# EAGLE design main_board (EAGLE 9.6.2)

## Sheet 1 of 4
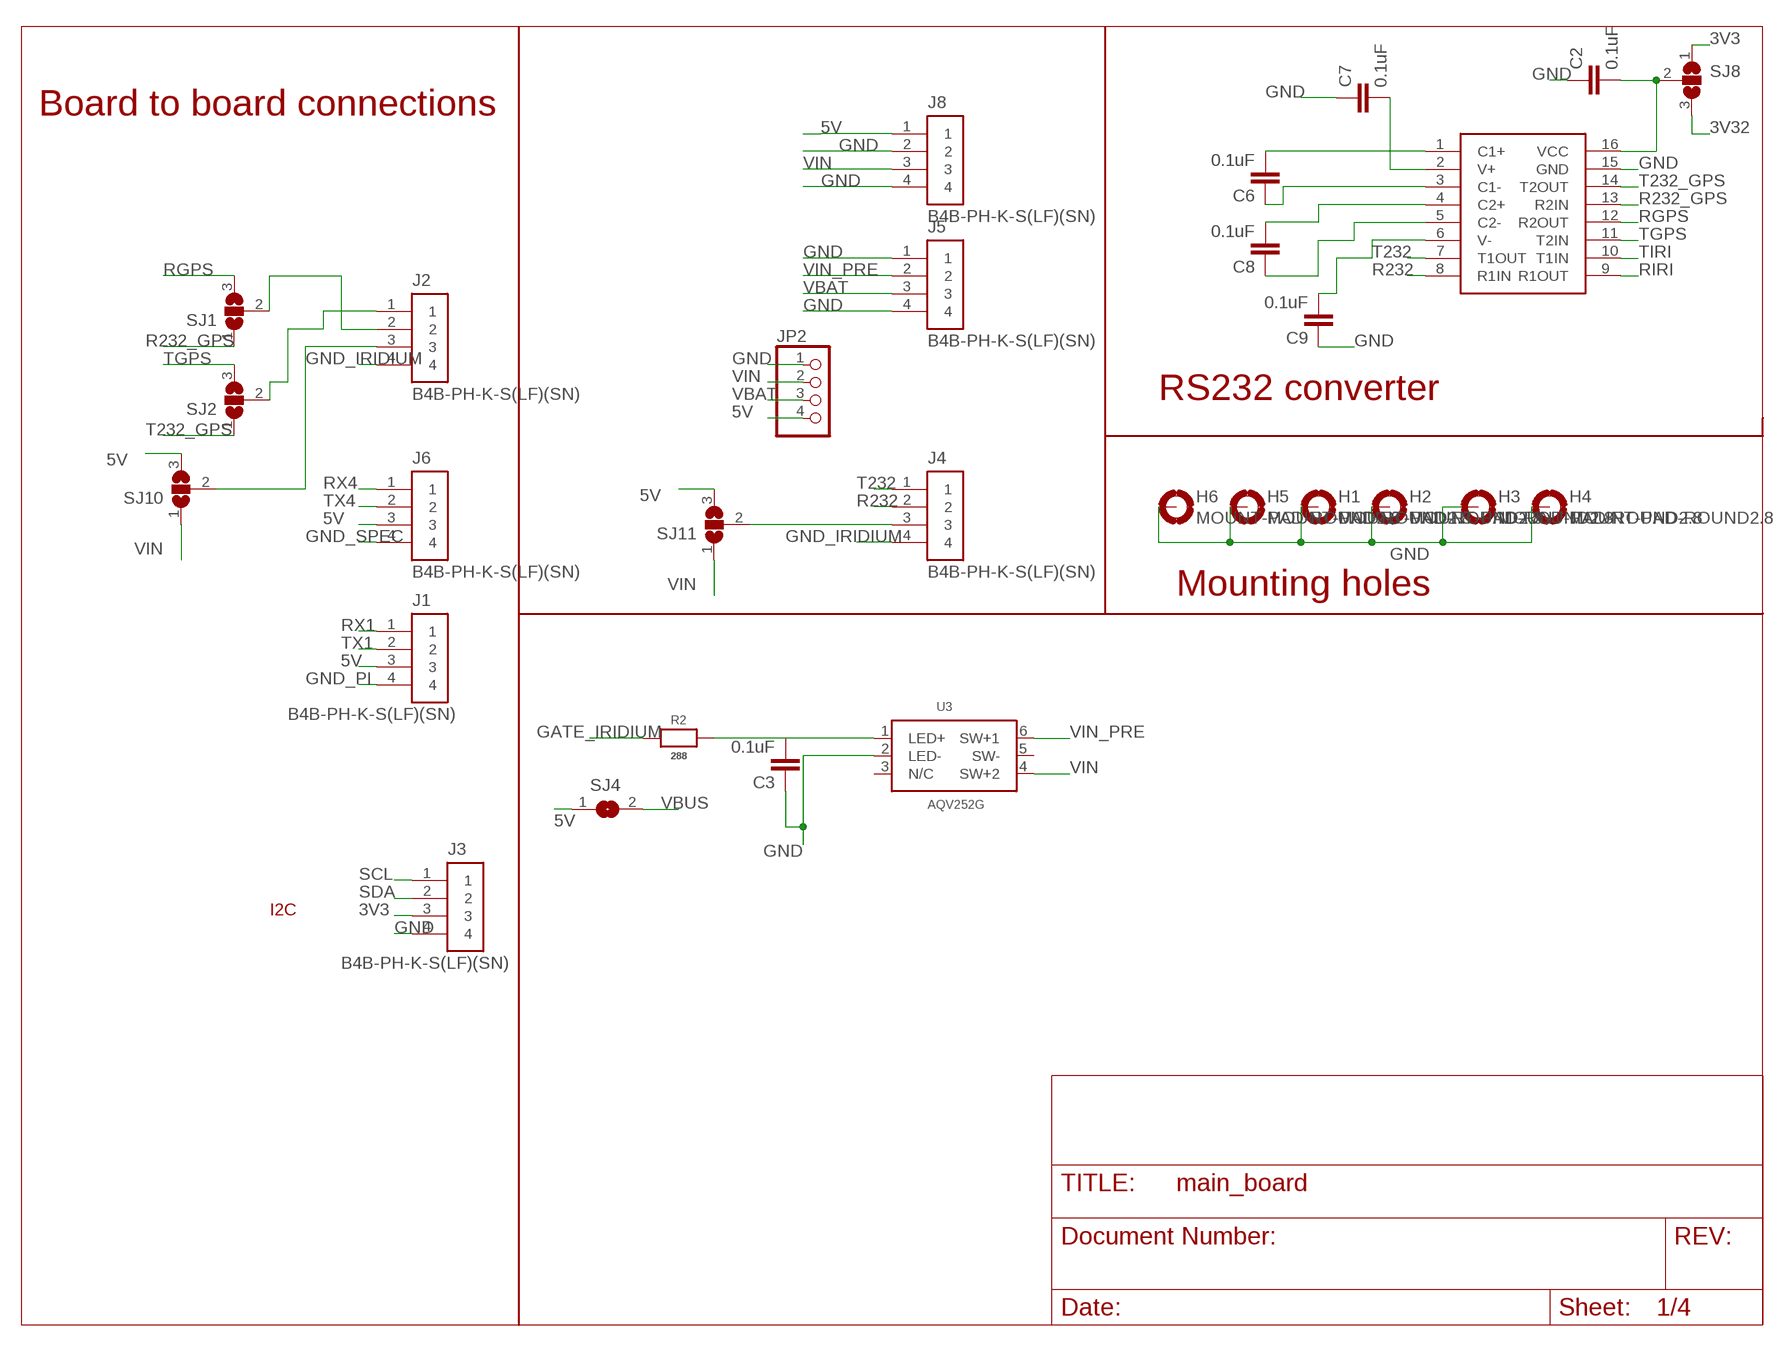
[diagram p0: schematic, sheet 1]

### Parts
C2  0.1uF  C-EUC0603  [C0603]
C3  0.1uF  C-EUC0603  [C0603]
C6  0.1uF  C-EUC0603  [C0603]
C7  0.1uF  C-EUC0603  [C0603]
C8  0.1uF  C-EUC0603  [C0603]
C9  0.1uF  C-EUC0603  [C0603]
H1  MOUNT-PAD-ROUND2.8  [2,8-PAD]
H2  MOUNT-PAD-ROUND2.8  [2,8-PAD]
H3  MOUNT-PAD-ROUND2.8  [2,8-PAD]
H4  MOUNT-PAD-ROUND2.8  [2,8-PAD]
H5  MOUNT-PAD-ROUND2.8  [2,8-PAD]
H6  MOUNT-PAD-ROUND2.8  [2,8-PAD]
J1  B4B-PH-K-S(LF)(SN)  [JST_B4B-PH-K-S(LF)(SN)]
J2  B4B-PH-K-S(LF)(SN)  [JST_B4B-PH-K-S(LF)(SN)]
J3  B4B-PH-K-S(LF)(SN)  [JST_B4B-PH-K-S(LF)(SN)]
J4  B4B-PH-K-S(LF)(SN)  [JST_B4B-PH-K-S(LF)(SN)]
J5  B4B-PH-K-S(LF)(SN)  [JST_B4B-PH-K-S(LF)(SN)]
J6  B4B-PH-K-S(LF)(SN)  [JST_B4B-PH-K-S(LF)(SN)]
J8  B4B-PH-K-S(LF)(SN)  [JST_B4B-PH-K-S(LF)(SN)]
JP2  PINHD-1X4  [1X04]
R2  288  RESISTOR_0603_NOOUT  [0603-NO]
SJ1  SJ2W  [SJ_2]
SJ2  SJ2W  [SJ_2]
SJ4  SJ  [SJ]
SJ8  SJ2W  [SJ_2]
SJ10  SJ2W  [SJ_2]
SJ11  SJ2W  [SJ_2]
U3  AQV252G  [SOP6]
U11  UM3232EEAE  [RQ_16_ADI]

### Nets
3V3: J3.3 SJ8.1 ; also sheet 2,3,4
3V32: SJ8.3 ; also sheet 2
5V: J1.3 J6.3 J8.1 JP2.4 SJ4.1 SJ10.3 SJ11.3 ; also sheet 2
GATE_IRIDIUM: R2.1 ; also sheet 2,4
GND [gnd]: C2.1 C3.1 C7.1 C9.1 H1.B2,8(MOUNT) H2.B2,8(MOUNT) H3.B2,8(MOUNT) H4.B2,8(MOUNT) H5.B2,8(MOUNT) H6.B2,8(MOUNT) J3.4 J5.1 J5.4 J8.2 J8.4 JP2.1 U3.2(LED-) U11.15(GND) ; also sheet 2,3,4
GND_IRIDIUM: J2.4 J4.4
GND_PI: J1.4
GND_SPEC: J6.4
N$3: J2.1 SJ2.2
N$4: J2.2 SJ1.2
N$5: C6.2 U11.1(C1+)
N$6: J2.3 SJ10.2
N$9: C2.2 SJ8.2 U11.16(VCC)
N$11: C7.2 U11.2(V+)
N$12: C6.1 U11.3(C1-)
N$13: C8.2 U11.4(C2+)
N$14: C8.1 U11.5(C2-)
N$15: C9.2 U11.6(V-)
N$16: J4.3 SJ11.2
N$18: C3.2 R2.2 U3.1(LED+)
R232: J4.2 U11.8(R1IN)
R232_GPS: SJ1.1 U11.13(R2IN)
RGPS: SJ1.3 U11.12(R2OUT) ; also sheet 2
RIRI: U11.9(R1OUT) ; also sheet 2
RX1: J1.1 ; also sheet 2
RX4: J6.1 ; also sheet 2
SCL: J3.1 ; also sheet 2,3,4
SDA: J3.2 ; also sheet 2,3,4
T232: J4.1 U11.7(T1OUT)
T232_GPS: SJ2.1 U11.14(T2OUT)
TGPS: SJ2.3 U11.11(T2IN) ; also sheet 2
TIRI: U11.10(T1IN) ; also sheet 2
TX1: J1.2 ; also sheet 2
TX4: J6.2 ; also sheet 2
VBAT: J5.3 JP2.3 ; also sheet 2
VBUS: SJ4.2 ; also sheet 2
VIN: J8.3 JP2.2 SJ10.1 SJ11.1 U3.4(SW+2)
VIN_PRE: J5.2 U3.6(SW+1)
Unconnected: U3.3(N/C) U3.5(SW-)

### Notes on the sheet
- Board to board connections
- RS232 converter
- Mounting holes
- I2C

## Sheet 2 of 4
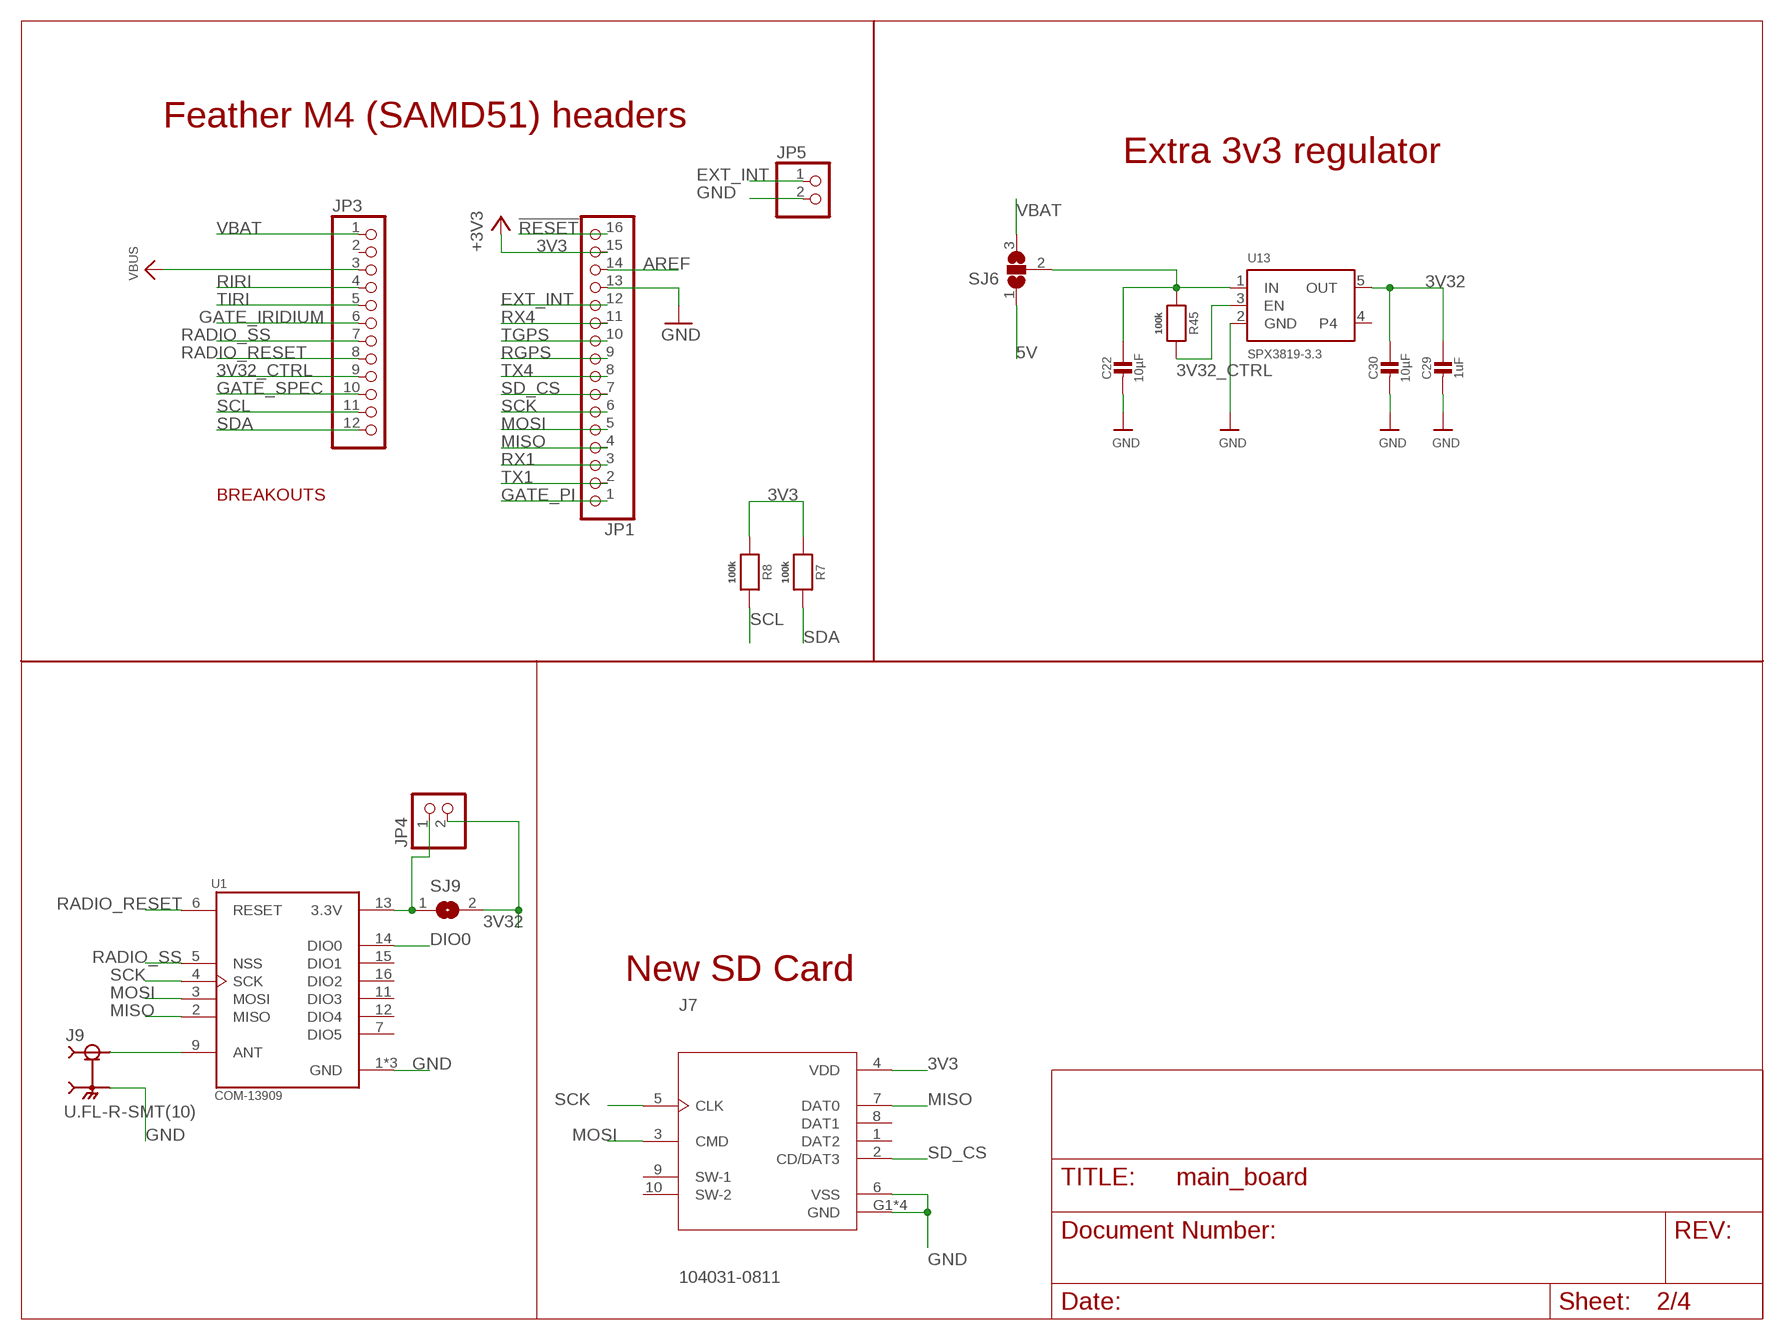
[diagram p1: schematic, sheet 2]

### Parts
C22  10µF  CAP_CERAMIC0805-NOOUTLINE  [0805-NO]
C29  1uF  CAP_CERAMIC0603_NO  [0603-NO]
C30  10µF  CAP_CERAMIC0805-NOOUTLINE  [0805-NO]
J7  104031-0811  [MOLEX_104031-0811]
J9  U.FL-R-SMT(10)  [HRS_U.FL-R-SMT(10)]
JP1  HEADER-1X16ROUND  [1X16_ROUND]
JP3  HEADER-1X12  [1X12_ROUND]
JP4  PINHD-1X2  [1X02]
JP5  PINHD-1X2  [1X02]
R7  100k  RESISTOR_0603_NOOUT  [0603-NO]
R8  100k  RESISTOR_0603_NOOUT  [0603-NO]
R45  100k  RESISTOR_0603_NOOUT  [0603-NO]
SJ6  SJ2W  [SJ_2]
SJ9  SJ  [SJ]
U1  COM-13909  [MOD_COM-13909]
U13  SPX3819-3.3  VREG_SOT23-5  [SOT23-5]

### Nets
3V3: J7.4(VDD) JP1.15 R7.1 R8.1 ; supply symbol labelled +3V3 ; also sheet 1,3,4
3V32: C29.1 C30.1 JP4.2 SJ9.2 U13.5(OUT) ; also sheet 1
3V32_CTRL: JP3.9 R45.2 U13.3(EN) ; also sheet 4
5V: SJ6.1 ; also sheet 1
!RESET: JP1.16
AREF: JP1.14
DIO0: U1.14(DIO0)
EXT_INT: JP1.12 JP5.1
GATE_IRIDIUM: JP3.6 ; also sheet 1,4
GATE_PI: JP1.1 ; also sheet 4
GATE_SPEC: JP3.10 ; also sheet 4
GND [gnd]: C22.2 C29.2 C30.2 J7.6(VSS) J7.G1(GND) J7.G2(GND) J7.G3(GND) J7.G4(GND) J9.2(GND) J9.3(GND) JP1.13 JP5.2 U1.1(GND) U1.8(GND) U1.10(GND) U13.2(GND) ; also sheet 1,3,4
MISO: J7.7(DAT0) JP1.4 U1.2(MISO)
MOSI: J7.3(CMD) JP1.5 U1.3(MOSI)
N$1: JP4.1 SJ9.1 U1.13(3.3V)
N$30: C22.1 R45.1 SJ6.2 U13.1(IN)
N$31: J9.1(SIG) U1.9(ANT)
RADIO_RESET: JP3.8 U1.6(RESET)
RADIO_SS: JP3.7 U1.5(NSS)
RGPS: JP1.9 ; also sheet 1
RIRI: JP3.4 ; also sheet 1
RX1: JP1.3 ; also sheet 1
RX4: JP1.11 ; also sheet 1
SCK: J7.5(CLK) JP1.6 U1.4(SCK)
SCL: JP3.11 R8.2 ; also sheet 1,3,4
SD_CS: J7.2(CD/DAT3) JP1.7
SDA: JP3.12 R7.2 ; also sheet 1,3,4
TGPS: JP1.10 ; also sheet 1
TIRI: JP3.5 ; also sheet 1
TX1: JP1.2 ; also sheet 1
TX4: JP1.8 ; also sheet 1
VBAT: JP3.1 SJ6.3 ; also sheet 1
VBUS: JP3.3 ; also sheet 1
Unconnected: J7.1(DAT2) J7.8(DAT1) J7.9(SW-1) J7.10(SW-2) JP3.2 U1.7(DIO5) U1.11(DIO3) U1.12(DIO4) U1.15(DIO1) U1.16(DIO2) U13.4

### Notes on the sheet
- Feather M4 (SAMD51) headers
- Extra 3v3 regulator
- BREAKOUTS
- New SD Card

## Sheet 3 of 4
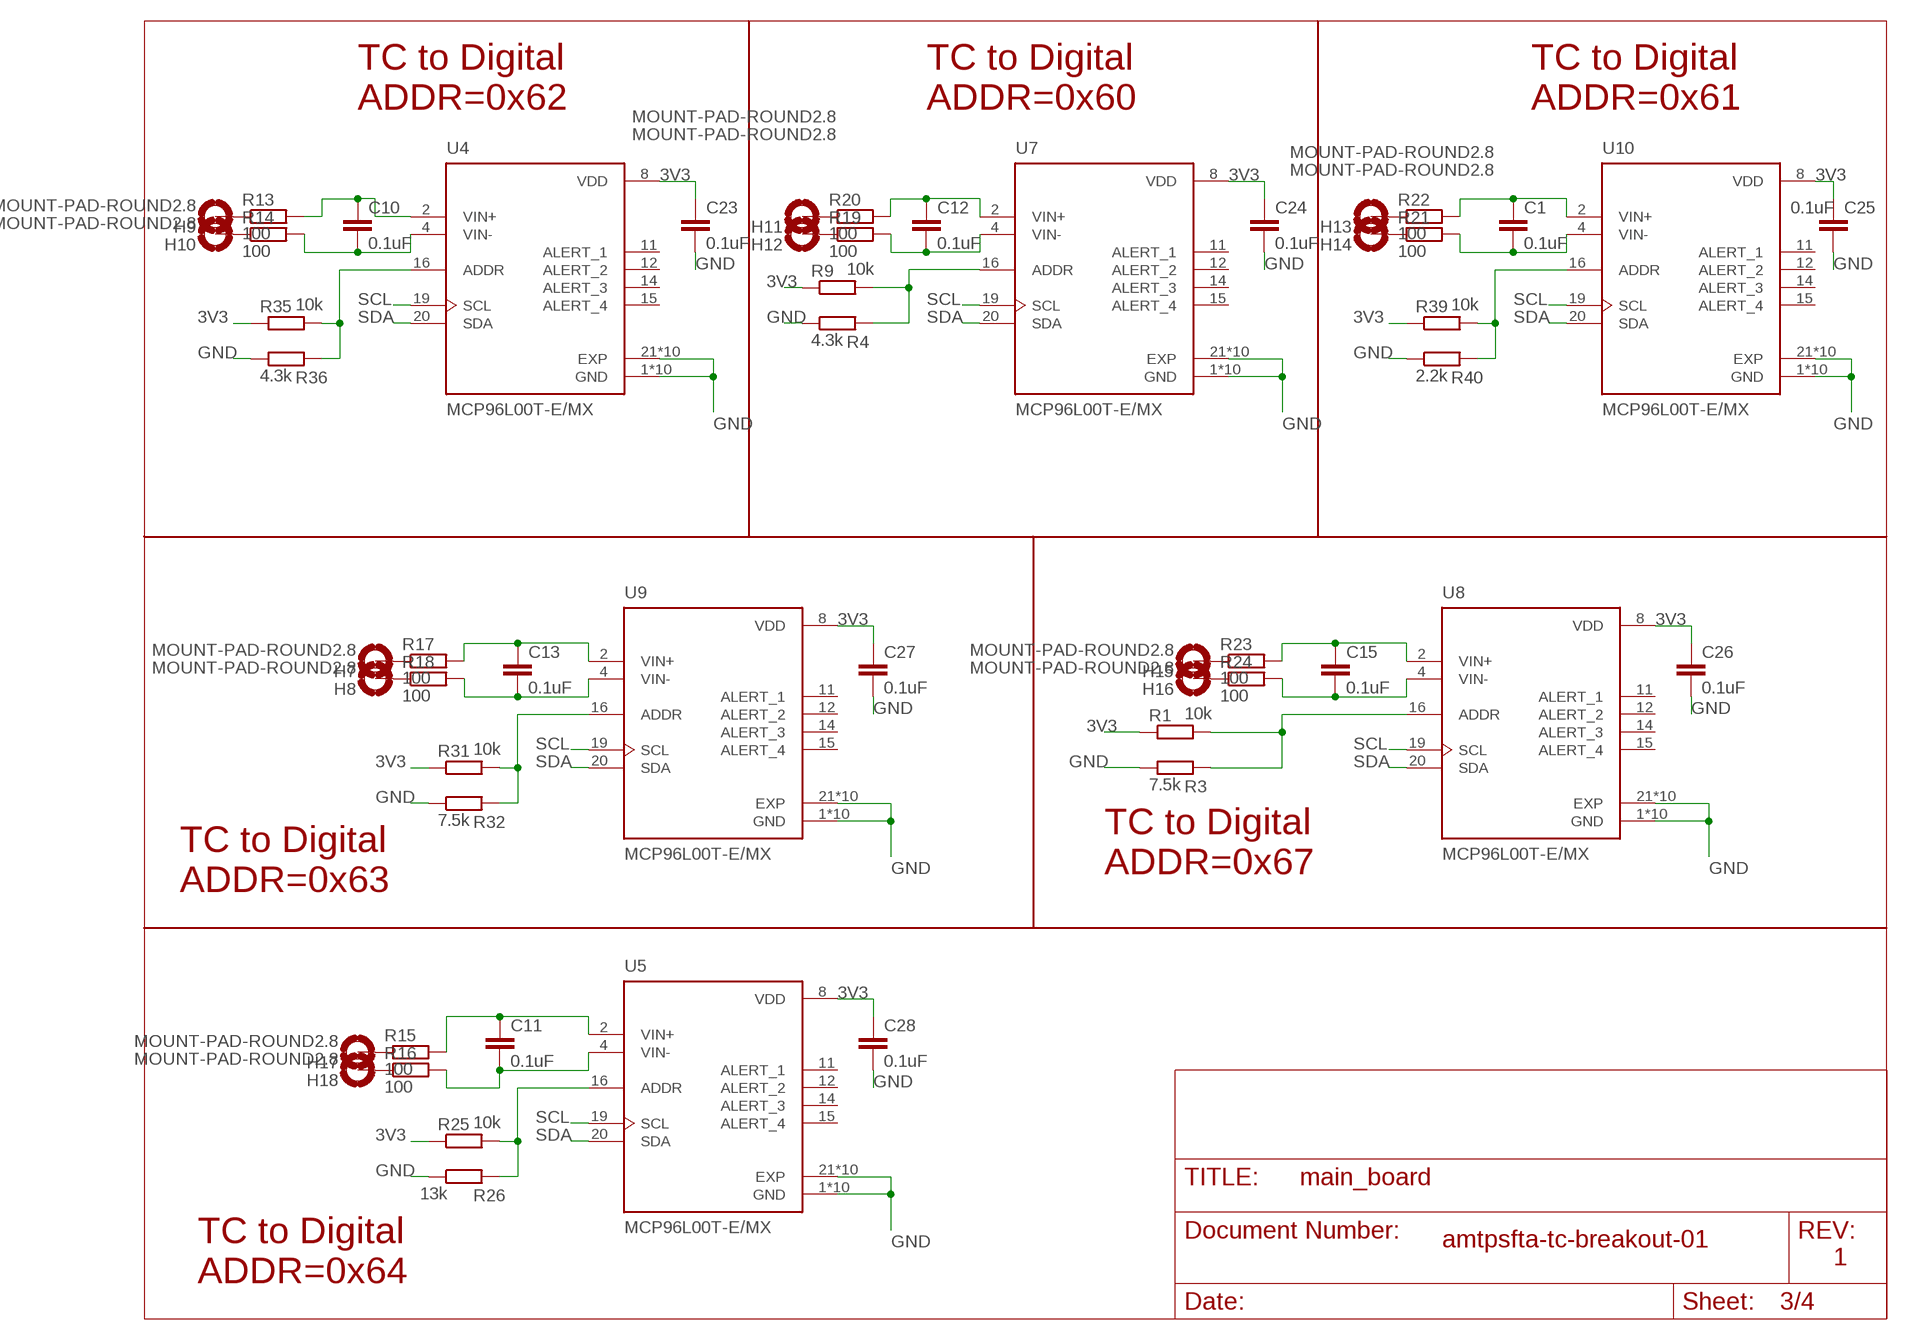
[diagram p2: schematic, sheet 3]

### Parts
C1  0.1uF  C-EUC0603  [C0603]
C10  0.1uF  C-EUC0603  [C0603]
C11  0.1uF  C-EUC0603  [C0603]
C12  0.1uF  C-EUC0603  [C0603]
C13  0.1uF  C-EUC0603  [C0603]
C15  0.1uF  C-EUC0603  [C0603]
C23  0.1uF  C-EUC0603  [C0603]
C24  0.1uF  C-EUC0603  [C0603]
C25  0.1uF  C-EUC0603  [C0603]
C26  0.1uF  C-EUC0603  [C0603]
C27  0.1uF  C-EUC0603  [C0603]
C28  0.1uF  C-EUC0603  [C0603]
H7  MOUNT-PAD-ROUND2.8  [2,8-PAD]
H8  MOUNT-PAD-ROUND2.8  [2,8-PAD]
H9  MOUNT-PAD-ROUND2.8  [2,8-PAD]
H10  MOUNT-PAD-ROUND2.8  [2,8-PAD]
H11  MOUNT-PAD-ROUND2.8  [2,8-PAD]
H12  MOUNT-PAD-ROUND2.8  [2,8-PAD]
H13  MOUNT-PAD-ROUND2.8  [2,8-PAD]
H14  MOUNT-PAD-ROUND2.8  [2,8-PAD]
H15  MOUNT-PAD-ROUND2.8  [2,8-PAD]
H16  MOUNT-PAD-ROUND2.8  [2,8-PAD]
H17  MOUNT-PAD-ROUND2.8  [2,8-PAD]
H18  MOUNT-PAD-ROUND2.8  [2,8-PAD]
R1  10k  R-EU_R0603  [R0603]
R3  7.5k  R-EU_R0603  [R0603]
R4  4.3k  R-EU_R0603  [R0603]
R9  10k  R-EU_R0603  [R0603]
R13  100  R-EU_R0603  [R0603]
R14  100  R-EU_R0603  [R0603]
R15  100  R-EU_R0603  [R0603]
R16  100  R-EU_R0603  [R0603]
R17  100  R-EU_R0603  [R0603]
R18  100  R-EU_R0603  [R0603]
R19  100  R-EU_R0603  [R0603]
R20  100  R-EU_R0603  [R0603]
R21  100  R-EU_R0603  [R0603]
R22  100  R-EU_R0603  [R0603]
R23  100  R-EU_R0603  [R0603]
R24  100  R-EU_R0603  [R0603]
R25  10k  R-EU_R0603  [R0603]
R26  13k  R-EU_R0603  [R0603]
R31  10k  R-EU_R0603  [R0603]
R32  7.5k  R-EU_R0603  [R0603]
R35  10k  R-EU_R0603  [R0603]
R36  4.3k  R-EU_R0603  [R0603]
R39  10k  R-EU_R0603  [R0603]
R40  2.2k  R-EU_R0603  [R0603]
U4  MCP96L00T-E/MX  [QFN65P500X500X100-21N_MCP96L00T-E/MX]
U5  MCP96L00T-E/MX  [QFN65P500X500X100-21N_MCP96L00T-E/MX]
U7  MCP96L00T-E/MX  [QFN65P500X500X100-21N_MCP96L00T-E/MX]
U8  MCP96L00T-E/MX  [QFN65P500X500X100-21N_MCP96L00T-E/MX]
U9  MCP96L00T-E/MX  [QFN65P500X500X100-21N_MCP96L00T-E/MX]
U10  MCP96L00T-E/MX  [QFN65P500X500X100-21N_MCP96L00T-E/MX]

### Nets
3V3: C23.1 C24.1 C25.1 C26.1 C27.1 C28.1 R1.1 R9.1 R25.1 R31.1 R35.1 R39.1 U4.8(VDD) U5.8(VDD) U7.8(VDD) U8.8(VDD) U9.8(VDD) U10.8(VDD) ; also sheet 1,2,4
GND [gnd]: C23.2 C24.2 C25.2 C26.2 C27.2 C28.2 R3.1 R4.1 R26.1 R32.1 R36.1 R40.1 U4.1(GND) U4.3(GND) U4.5(GND) U4.6(GND) U4.7(GND) U4.9(GND) U4.10(GND) U4.13(GND) U4.17(GND) U4.18(GND) U4.21(EXP) U4.22(EXP) U4.23(EXP) U4.24(EXP) U4.25(EXP) U4.26(EXP) U4.27(EXP) U4.28(EXP) U4.29(EXP) U4.30(EXP) U5.1(GND) U5.3(GND) U5.5(GND) U5.6(GND) U5.7(GND) U5.9(GND) U5.10(GND) U5.13(GND) U5.17(GND) U5.18(GND) U5.21(EXP) U5.22(EXP) U5.23(EXP) U5.24(EXP) U5.25(EXP) U5.26(EXP) U5.27(EXP) U5.28(EXP) U5.29(EXP) U5.30(EXP) U7.1(GND) U7.3(GND) U7.5(GND) U7.6(GND) U7.7(GND) U7.9(GND) U7.10(GND) U7.13(GND) U7.17(GND) U7.18(GND) U7.21(EXP) U7.22(EXP) U7.23(EXP) U7.24(EXP) U7.25(EXP) U7.26(EXP) U7.27(EXP) U7.28(EXP) U7.29(EXP) U7.30(EXP) U8.1(GND) U8.3(GND) U8.5(GND) U8.6(GND) U8.7(GND) U8.9(GND) U8.10(GND) U8.13(GND) U8.17(GND) U8.18(GND) U8.21(EXP) U8.22(EXP) U8.23(EXP) U8.24(EXP) U8.25(EXP) U8.26(EXP) U8.27(EXP) U8.28(EXP) U8.29(EXP) U8.30(EXP) U9.1(GND) U9.3(GND) U9.5(GND) U9.6(GND) U9.7(GND) U9.9(GND) U9.10(GND) U9.13(GND) U9.17(GND) U9.18(GND) U9.21(EXP) U9.22(EXP) U9.23(EXP) U9.24(EXP) U9.25(EXP) U9.26(EXP) U9.27(EXP) U9.28(EXP) U9.29(EXP) U9.30(EXP) U10.1(GND) U10.3(GND) U10.5(GND) U10.6(GND) U10.7(GND) U10.9(GND) U10.10(GND) U10.13(GND) U10.17(GND) U10.18(GND) U10.21(EXP) U10.22(EXP) U10.23(EXP) U10.24(EXP) U10.25(EXP) U10.26(EXP) U10.27(EXP) U10.28(EXP) U10.29(EXP) U10.30(EXP) ; also sheet 1,2,4
N$2: H7.B2,8(MOUNT) R17.1
N$8: H8.B2,8(MOUNT) R18.1
N$10: R1.2 R3.2 U8.16(ADDR)
N$17: R4.2 R9.2 U7.16(ADDR)
N$20: H9.B2,8(MOUNT) R13.1
N$21: H10.B2,8(MOUNT) R14.1
N$22: H11.B2,8(MOUNT) R20.1
N$23: H12.B2,8(MOUNT) R19.1
N$24: H13.B2,8(MOUNT) R22.1
N$25: H14.B2,8(MOUNT) R21.1
N$26: H15.B2,8(MOUNT) R23.1
N$27: H16.B2,8(MOUNT) R24.1
N$28: H17.B2,8(MOUNT) R15.1
N$29: H18.B2,8(MOUNT) R16.1
N$32: C10.1 R13.2 U4.2(VIN+)
N$34: C10.2 R14.2 U4.4(VIN-)
N$45: C12.1 R20.2 U7.2(VIN+)
N$46: C12.2 R19.2 U7.4(VIN-)
N$47: C15.1 R23.2 U8.2(VIN+)
N$48: C1.2 R21.2 U10.4(VIN-)
N$49: C15.2 R24.2 U8.4(VIN-)
N$50: C1.1 R22.2 U10.2(VIN+)
N$51: C13.1 R17.2 U9.2(VIN+)
N$53: C13.2 R18.2 U9.4(VIN-)
N$54: C11.1 R15.2 U5.2(VIN+)
N$55: C11.2 R16.2 U5.4(VIN-)
N$57: R25.2 R26.2 U5.16(ADDR)
N$58: R31.2 R32.2 U9.16(ADDR)
N$60: R35.2 R36.2 U4.16(ADDR)
N$62: R39.2 R40.2 U10.16(ADDR)
SCL: U4.19(SCL) U5.19(SCL) U7.19(SCL) U8.19(SCL) U9.19(SCL) U10.19(SCL) ; also sheet 1,2,4
SDA: U4.20(SDA) U5.20(SDA) U7.20(SDA) U8.20(SDA) U9.20(SDA) U10.20(SDA) ; also sheet 1,2,4
Unconnected: U4.11(ALERT_1) U4.12(ALERT_2) U4.14(ALERT_3) U4.15(ALERT_4) U5.11(ALERT_1) U5.12(ALERT_2) U5.14(ALERT_3) U5.15(ALERT_4) U7.11(ALERT_1) U7.12(ALERT_2) U7.14(ALERT_3) U7.15(ALERT_4) U8.11(ALERT_1) U8.12(ALERT_2) U8.14(ALERT_3) U8.15(ALERT_4) U9.11(ALERT_1) U9.12(ALERT_2) U9.14(ALERT_3) U9.15(ALERT_4) U10.11(ALERT_1) U10.12(ALERT_2) U10.14(ALERT_3) U10.15(ALERT_4)

### Notes on the sheet
- TC to Digital
  ADDR=0x62
- TC to Digital
  ADDR=0x60
- TC to Digital
  ADDR=0x61
- TC to Digital
  ADDR=0x67
- TC to Digital
  ADDR=0x63
- amtpsfta-tc-breakout-01
- 1
- TC to Digital
  ADDR=0x64

## Sheet 4 of 4
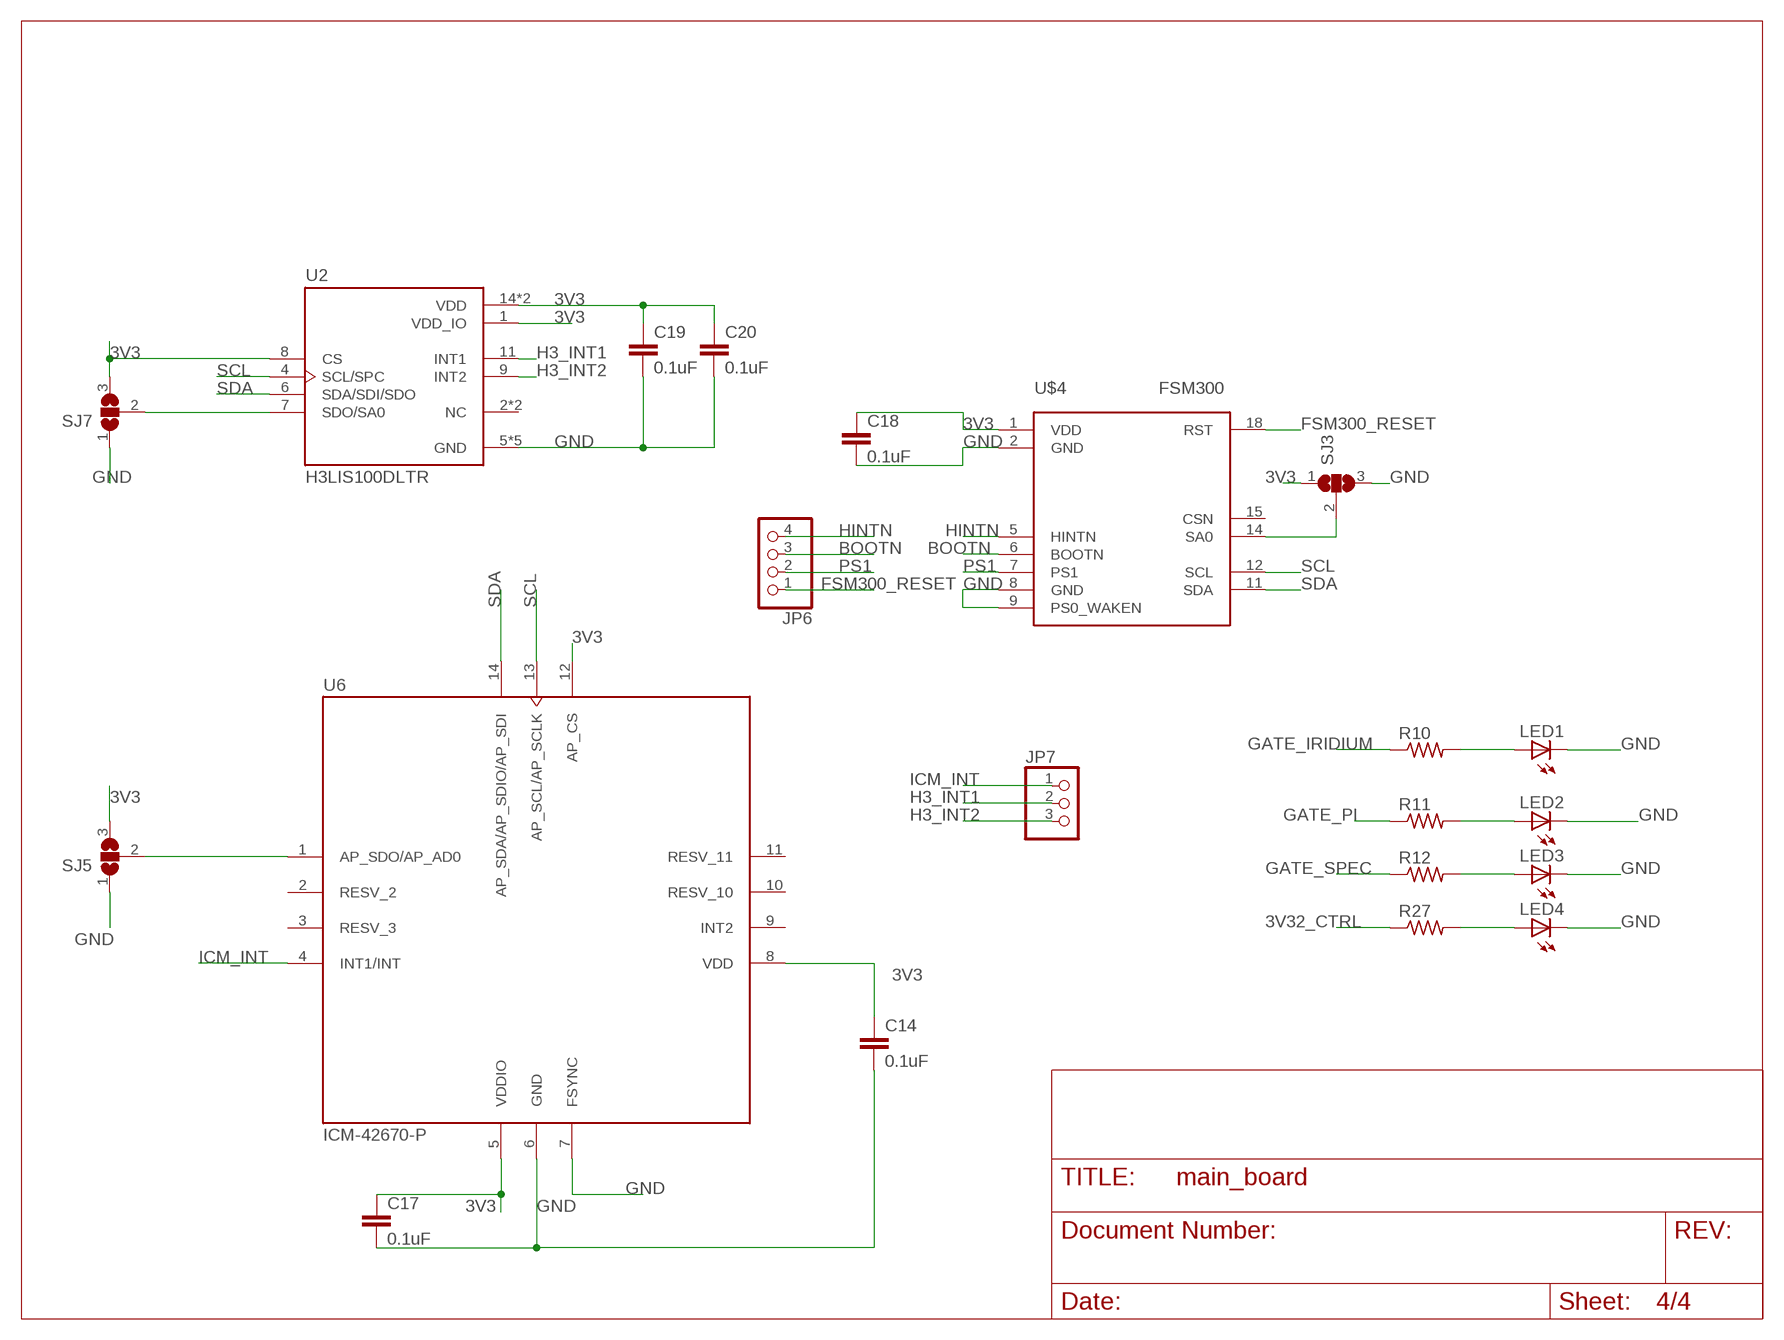
[diagram p3: schematic, sheet 4]

### Parts
C14  0.1uF  C-EUC0603  [C0603]
C17  0.1uF  C-EUC0603  [C0603]
C18  0.1uF  C-EUC0603  [C0603]
C19  0.1uF  C-EUC0603  [C0603]
C20  0.1uF  C-EUC0603  [C0603]
JP6  PINHD-1X4  [1X04]
JP7  PINHD-1X3  [1X03]
LED1  LEDCHIPLED_0603  [CHIPLED_0603]
LED2  LEDCHIPLED_0603  [CHIPLED_0603]
LED3  LEDCHIPLED_0603  [CHIPLED_0603]
LED4  LEDCHIPLED_0603  [CHIPLED_0603]
R10  R-US_R0603  [R0603]
R11  R-US_R0603  [R0603]
R12  R-US_R0603  [R0603]
R27  R-US_R0603  [R0603]
SJ3  SJ2W  [SJ_2]
SJ5  SJ2W  [SJ_2]
SJ7  SJ2W  [SJ_2]
U2  H3LIS100DLTR  [PQFN50P300X300X100-16N]
U6  ICM-42670-P  [IC_ICM-42670-P]
U$4  FSM300  [FSM300_FOOTPRINT]

### Nets
3V3: C14.1 C17.1 C18.1 C19.1 C20.1 SJ3.1 SJ5.3 SJ7.3 U2.1(VDD_IO) U2.8(CS) U2.14(VDD) U2.15(VDD) U6.5(VDDIO) U6.8(VDD) U6.12(AP_CS) U$4.1(VDD) ; also sheet 1,2,3
3V32_CTRL: R27.1 ; also sheet 2
BOOTN: JP6.3 U$4.6(BOOTN)
FSM300_RESET: JP6.1 U$4.18(RST)
GATE_IRIDIUM: R10.1 ; also sheet 1,2
GATE_PI: R11.1 ; also sheet 2
GATE_SPEC: R12.1 ; also sheet 2
GND [gnd]: C14.2 C17.2 C18.2 C19.2 C20.2 LED1.C LED2.C LED3.C LED4.C SJ3.3 SJ5.1 SJ7.1 U2.5(GND) U2.10(GND) U2.12(GND) U2.13(GND) U2.16(GND) U6.6(GND) U6.7(FSYNC) U$4.2(GND) U$4.8(GND) U$4.9(PS0_WAKEN) ; also sheet 1,2,3
H3_INT1: JP7.2 U2.11(INT1)
H3_INT2: JP7.3 U2.9(INT2)
HINTN: JP6.4 U$4.5(HINTN)
ICM_INT: JP7.1 U6.4(INT1/INT)
N$7: SJ5.2 U6.1(AP_SDO/AP_AD0)
N$19: LED1.A R10.2
N$33: LED2.A R11.2
N$35: SJ7.2 U2.7(SDO/SA0)
N$36: LED3.A R12.2
N$37: LED4.A R27.2
N$44: SJ3.2 U$4.14(SA0)
PS1: JP6.2 U$4.7(PS1)
SCL: U2.4(SCL/SPC) U6.13(AP_SCL/AP_SCLK) U$4.12(SCL) ; also sheet 1,2,3
SDA: U2.6(SDA/SDI/SDO) U6.14(AP_SDA/AP_SDIO/AP_SDI) U$4.11(SDA) ; also sheet 1,2,3
Unconnected: U2.2(NC) U2.3(NC) U6.2(RESV_2) U6.3(RESV_3) U6.9(INT2) U6.10(RESV_10) U6.11(RESV_11) U$4.15(CSN)

## Library data of the parts
C1-C3 C6-C15 C17-C20 C23-C28 = rcl:C-EU: CAPACITOR, European symbol; SPICEPREFIX: C
C22 C29 C30 = microbuilder:CAP_CERAMIC: Ceramic Capacitors For new designs, use the packages preceded by an '_' character since they are more reliable: The following footprints should be used on most boards: _0402 - Standard footprint for regular board layouts _0603 - Standard footprint for regular board layouts _0805 - Standard footprint for regular board layouts _1206 - Standard footprint for regular board layouts For extremely tight-pitch boards where space is at a premium, the following 'micro-pitch' footprints can be used (smaller pads, no silkscreen outline, etc.): _0402MP - Micro-pitch footprint for very dense/compact boards _0603MP - Micro-pitch footprint for very dense/compact boards _0805MP - Micro-pitch footprint for very dense/compact boards _1206MP - Micro-pitch footprint for very dense/compact boards
H1-H18 = holes:MOUNT-PAD-ROUND: MOUNTING PAD, round
J1-J6 J8 = B4B-PH-K-S_LF__SN_:B4B-PH-K-S(LF)(SN): PH Series 4 Position 2 mm Pitch Through Hole Crimp Top Entry Shrouded Header; DESCRIPTION: Connector Header Through Hole 4 position 0.079 (2.00mm); DIGI-KEY_PART_NUMBER: 455-1706-ND; MF: JST; MP: B4B-PH-K-S(LF)(SN); PACKAGE: None; PURCHASE-URL: https://pricing.snapeda.com/search/part/B4B-PH-K-S(LF)(SN)/?ref=eda
J7 = 104031-0811:104031-0811: 10 (8 + 2) Position Card Connector Secure Digital - microSD™ Surface Mount, Right Angle Gold; DESCRIPTION: 10 (8 + 2) Position Card Connector Secure Digital - microSD™ Surface Mount, Right Angle Gold; DIGI-KEY_PART_NUMBER: WM6357TR-ND; MF: Molex; MP: 104031-0811; PACKAGE: None; PURCHASE-URL: https://pricing.snapeda.com/search/part/104031-0811/?ref=eda
J9 = U.FL-R-SMT_10_:U.FL-R-SMT(10): U.FL Series 50 Ohm Receptacle Male Pins Ultra Small SMT Coaxial Connector; DESCRIPTION: U.FL (UMCC) Connector Receptacle, Male Pin 50Ohm Surface Mount Solder; DIGI-KEY_PART_NUMBER: H9161TR-ND; MF: Hirose Electric Co Ltd; MP: U.FL-R-SMT(10); PACKAGE: None; PURCHASE-URL: https://pricing.snapeda.com/search/part/U.FL-R-SMT(10)/?ref=eda
JP1 = microbuilder:HEADER-1X16: PIN HEADER
JP2 JP6 = pinhead:PINHD-1X4: PIN HEADER
JP3 = microbuilder:HEADER-1X12
JP4 JP5 = pinhead:PINHD-1X2: PIN HEADER
JP7 = pinhead:PINHD-1X3: PIN HEADER
LED1-LED4 = adafruit:LED: LED OSRAM: - CHIPLED LG R971, LG N971, LY N971, LG Q971, LY Q971, LO R971, LY R971 LH N974, LH R974 LS Q976, LO Q976, LY Q976 LO Q996 - Hyper CHIPLED LW Q18S LB Q993, LB Q99A, LB R99A - SideLED LS A670, LO A670, LY A670, LG A670, LP A670 LB A673, LV A673, LT A673, LW A673 LH A674 LY A675 LS A676, LA A676, LO A676, LY A676, LW A676 LS A679, LY A679, LG A679 - Hyper Micro SIDELED® LS Y876, LA Y876, LO Y876, LY Y876 LT Y87S - SmartLED LW L88C, LW L88S LB L89C, LB L89S, LG L890 LS L89K, LO L89K, LY L89K LS L896, LA L896, LO L896, LY L896 - TOPLED LS T670, LO T670, LY T670, LG T670, LP T670 LSG T670, LSP T670, LSY T670, LOP T670, LYG T670 LG T671, LOG T671, LSG T671 LB T673, LV T673, LT T673, LW T673 LH T674 LS T676, LA T676, LO T676, LY T676, LB T676, LH T676, LSB T676, LW T676 LB T67C, LV T67C, LT T67C, LS T67K, LO T67K, LY T67K, LW E67C LS E67B, LA E67B, LO E67B, LY E67B, LB E67C, LV E67C, LT E67C LW T67C LS T679, LY T679, LG T679 LS T770, LO T770, LY T770, LG T770, LP T770 LB T773, LV T773, LT T773, LW T773 LH T774 LS E675, LA E675, LY E675, LS T675 LS T776, LA T776, LO T776, LY T776, LB T776 LHGB T686 LT T68C, LB T68C - Hyper Mini TOPLED® LB M676 - Mini TOPLED Santana® LG M470 LS M47K, LO M47K, LY M47K Source: http://www.osram.convergy.de/
R1 R3 R4 R9 R13-R26 R31 R32 R35 R36 R39 R40 = rcl:R-EU_: RESISTOR, European symbol; SPICEPREFIX: R
R2 R7 R8 R45 = microbuilder:RESISTOR: Resistors For new designs, use the packages preceded by an '_' character since they are more reliable: The following footprints should be used on most boards: _0402 - Standard footprint for regular board layouts _0603 - Standard footprint for regular board layouts _0805 - Standard footprint for regular board layouts _1206 - Standard footprint for regular board layouts For extremely tight-pitch boards where space is at a premium, the following 'micro-pitch' footprints can be used (smaller pads, no silkscreen outline, etc.): _0402MP - Micro-pitch footprint for very dense/compact boards _0603MP - Micro-pitch footprint for very dense/compact boards _0805MP - Micro-pitch footprint for very dense/compact boards _1206MP - Micro-pitch footprint for very dense/compact boards
R10-R12 R27 = rcl:R-US_: RESISTOR, American symbol; SPICEPREFIX: R
SJ1-SJ3 SJ5-SJ8 SJ10 SJ11 = jumper:SJ2W: SMD solder JUMPER
SJ4 SJ9 = jumper:SJ: SMD solder JUMPER
U1 = COM-13909:COM-13909: Rfm69hcw Wireless Transceiver 91; DESCRIPTION: General ISM < 1GHz Transceiver Module 915MHz Surface Mount; DIGI-KEY_PART_NUMBER: 1568-1394-ND; DIGI-KEY_PURCHASE_URL: https://www.digikey.com/product-detail/en/sparkfun-electronics/COM-13909/1568-1394-ND/6023504?utm_source=snapeda&utm_medium=aggregator&utm_campaign=symbol; MF: SparkFun Electronics; MP: COM-13909; PACKAGE: Module SparkFun Electronics
U2 = H3LIS100DLTR:H3LIS100DLTR: Accelerometer X, Y, Z Axis ±100g 25Hz ~ 200Hz 16-TFLGA (3x3); DESCRIPTION: Accelerometer X, Y, Z Axis ±100g 25Hz ~ 200Hz 16-TFLGA (3x3); DIGI-KEY_PART_NUMBER: 497-15697-2-ND; MF: STMicroelectronics; MP: H3LIS100DLTR; PACKAGE: TFLGA-16 STMicroelectronics; PURCHASE-URL: https://pricing.snapeda.com/search/part/H3LIS100DLTR/?ref=eda
U3 = AQV252G:AQV252G; DESCRIPTION: Solid State SPST-NO (1 Form A) 6-SMD (0.300, 7.62mm); DIGI-KEY_PART_NUMBER: 255-1791-5-ND; MF: Panasonic; MP: AQV252G; PACKAGE: None; PURCHASE-URL: https://pricing.snapeda.com/search/part/AQV252G/?ref=eda
U4 U5 U7-U10 = MCP96L00T-E_MX:MCP96L00T-E/MX: MCP9600 Series Thermocouple Electromotive Force to ±1.5°C Converter - VQFN-2; DESCRIPTION: +/- 4.0C THERMOCOUPLE TO I2C CON; DIGI-KEY_PART_NUMBER: MCP96L00T-E/MXCT-ND; MF: Microchip Technology; MP: MCP96L00T-E/MX; PACKAGE: VQFN-20 Microchip; PURCHASE-URL: https://pricing.snapeda.com/search/part/MCP96L00T-E/MX/?ref=eda
U6 = ICM-42670-P:ICM-42670-P; DESCRIPTION: Low-Power, Premium Performance 6-Axis MotionTrackingTM IMU with I3C, I2C and SPI interface in 2.5mm x 3mm Package; DIGI-KEY_PART_NUMBER: 1428-ICM-42670-PTR-ND; MF: TDK InvenSense; MP: ICM-42670-P; PACKAGE: None; PURCHASE-URL: https://pricing.snapeda.com/search/part/ICM-42670-P/?ref=eda
U11 = ADM310:UM3232EEAE
U13 = microbuilder:VREG_SOT23-5: SOT23-5 Fixed Voltage Regulators Part Current Out V Out V In V Dropout θJA (°C/W) TJ (°C) Digikey Part No. ADP121 150mA 3.3V 3.4-5.5V 0.09V @ 150mA -- -- ADP121-AUJZ33R7CT-ND ADP121 150mA 3.0V 3.1-5.5V 0.09V @ 150mA -- -- ADP121-AUJZ30R7CT-ND ADP122 300mA 3.3V 3.4-5.5V 0.085V @ 300mA -- -- ADP122AUJZ-3.3-R7CT-ND ADP1712 300mA 3.3V 3.5-5.5V 0.17V @ 300mA -- -- ADP1712AUJZ-3.3-R7TR-ND AP7311 (Low Cost) 150mA 3.3V 3.5-6V 0.15V @ 150mA -- -- AP7311-33WG-7DICT-ND LD39015M18R 150mA 1.8V 1.9V-5.5V 0.08V @ 100mA -- -- 497-6977-1-ND LP2985A-33DBVR 150mA 3.3V 3.3-16V 0.28V @ 150mA 206 150 296-18479-1-ND MCP1824T-3302E/OT 300mA 3.3V 3.5V-6V 0.2V @ 300mA -- -- MCP1824T-3302E/OTCT-ND MIC5205-2.5YM5 TR 150mA 2.5V 2.7-16V 0.165V @ 150mA -- -- 576-1257-2-ND MIC5205-3.0YM5 TR 150mA 3.0V 3.2V-16V 0.165V @ 150mA -- -- 576-1258-2-ND MIC5205-3.3YM5 TR 150mA 3.3V 3.5V-16V 0.165V @ 150mA -- -- 576-1259-2-ND TPS780330220 150mA 3.3V+2.2V 3.6-5.5V 250mV Max -- -- 296-23332-1-ND TDA3663/N1,135 100mA 3.3V 3.5-45V 0.18V @ 50mA -- -- 568-5343-1-ND Max operating temp can be calculated using θJA, TJ (max junction temperature), and power in watts. Set the "Maximum Ambient Temperature" until it reaches TJ ("Max Junction Temperature"), which is the absolute limit for safe use of the regulator: Heat Sink Temperature Calculator <http://www.daycounter.com/Calculators/Heat-Sink-Temperature-Calculator.phtml> For example, With 12V source into a 3.3V LP2985 and a 30mA load, we are dissipating (12V-3.3V) * 0.03A = 0.261W. With a θJA of 206 °C/W, a TJ of 150°C, and 261mW we can safely use the chip without a heat sink up to 75°C (=147.1°C Junction Temperature).
U$4 = COM-13909:FSM300

## Net classes
1 power: width 0.305 mm
2 gnd: width 0.254 mm

## Board
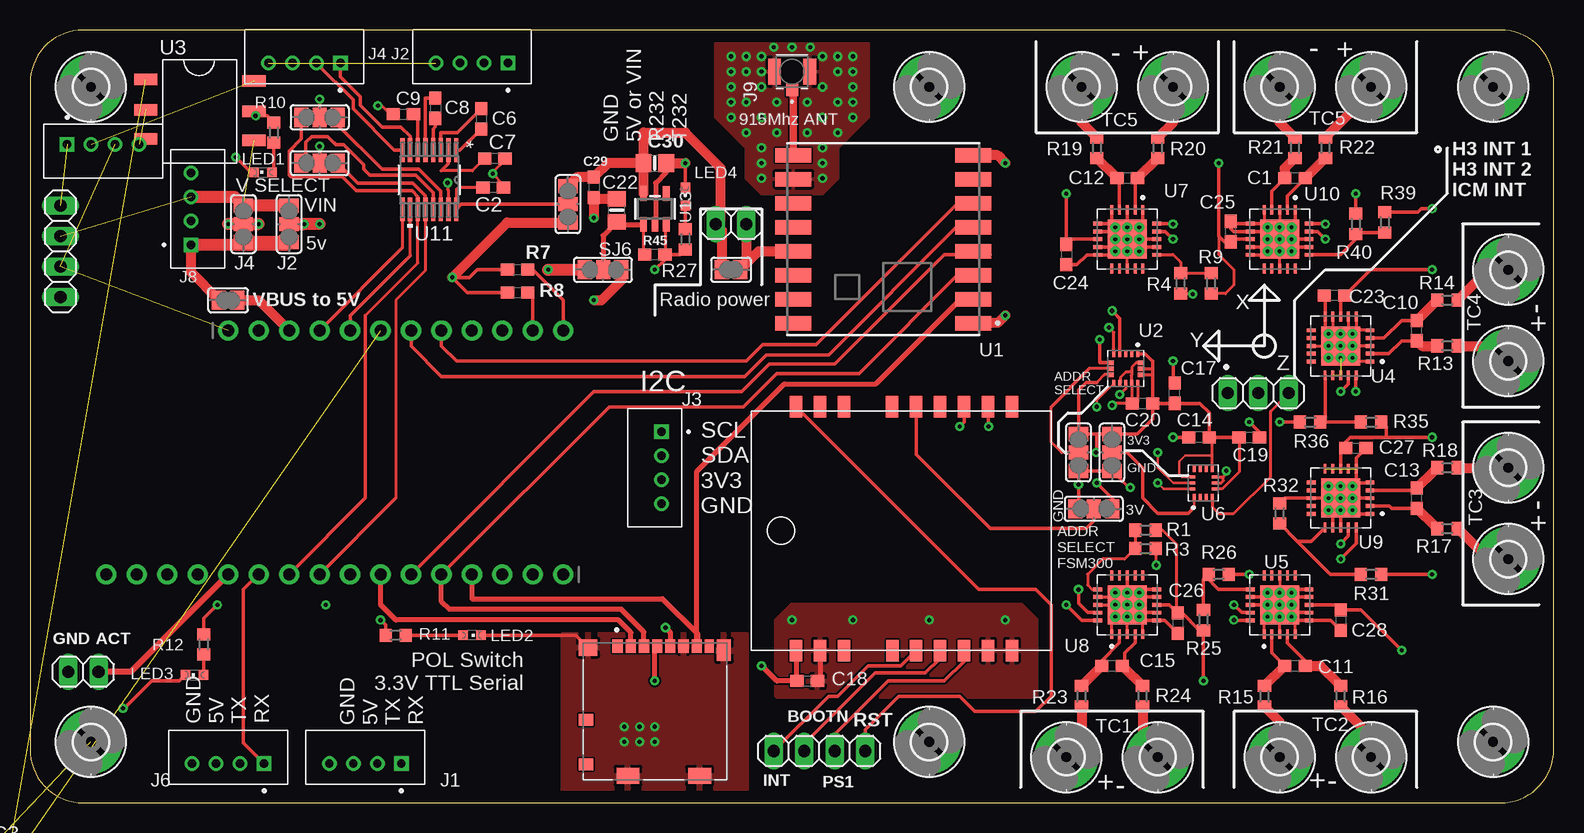
[diagram p4: board, top side]
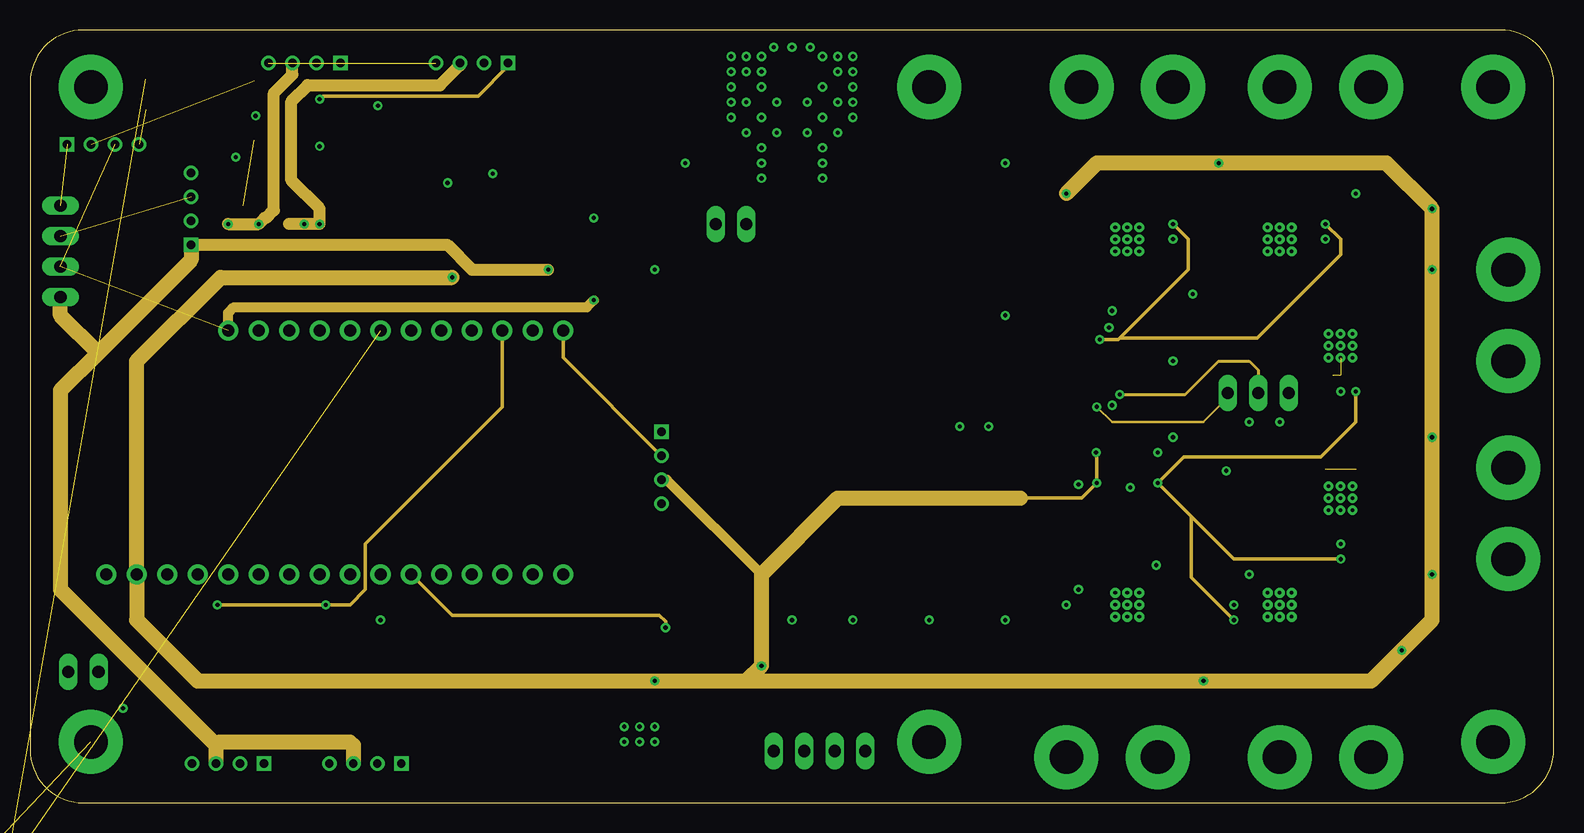
[diagram p5: board, inner layer Route2]
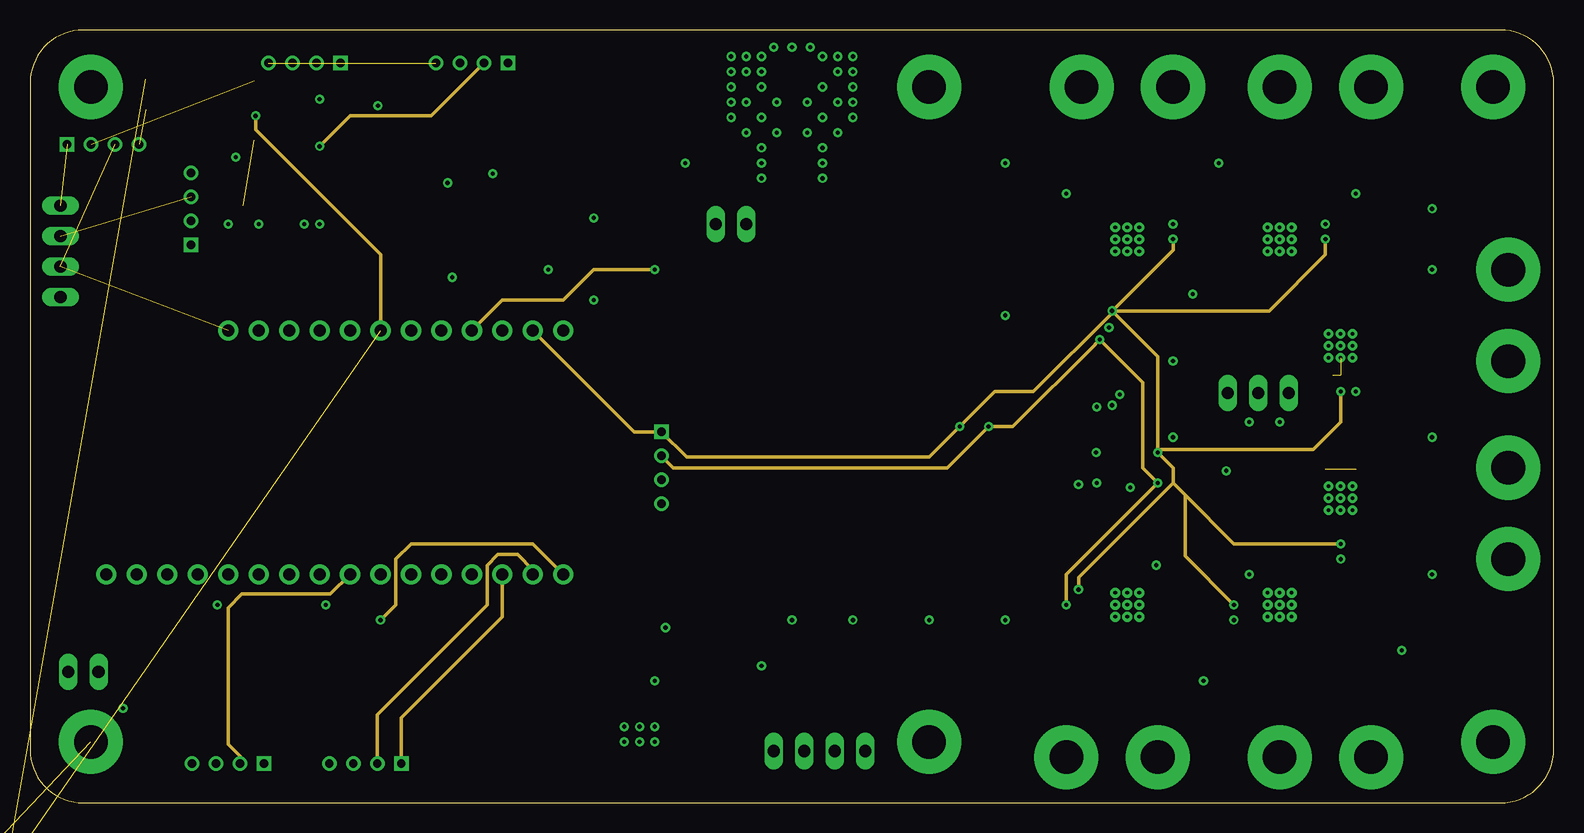
[diagram p6: board, inner layer Route15]
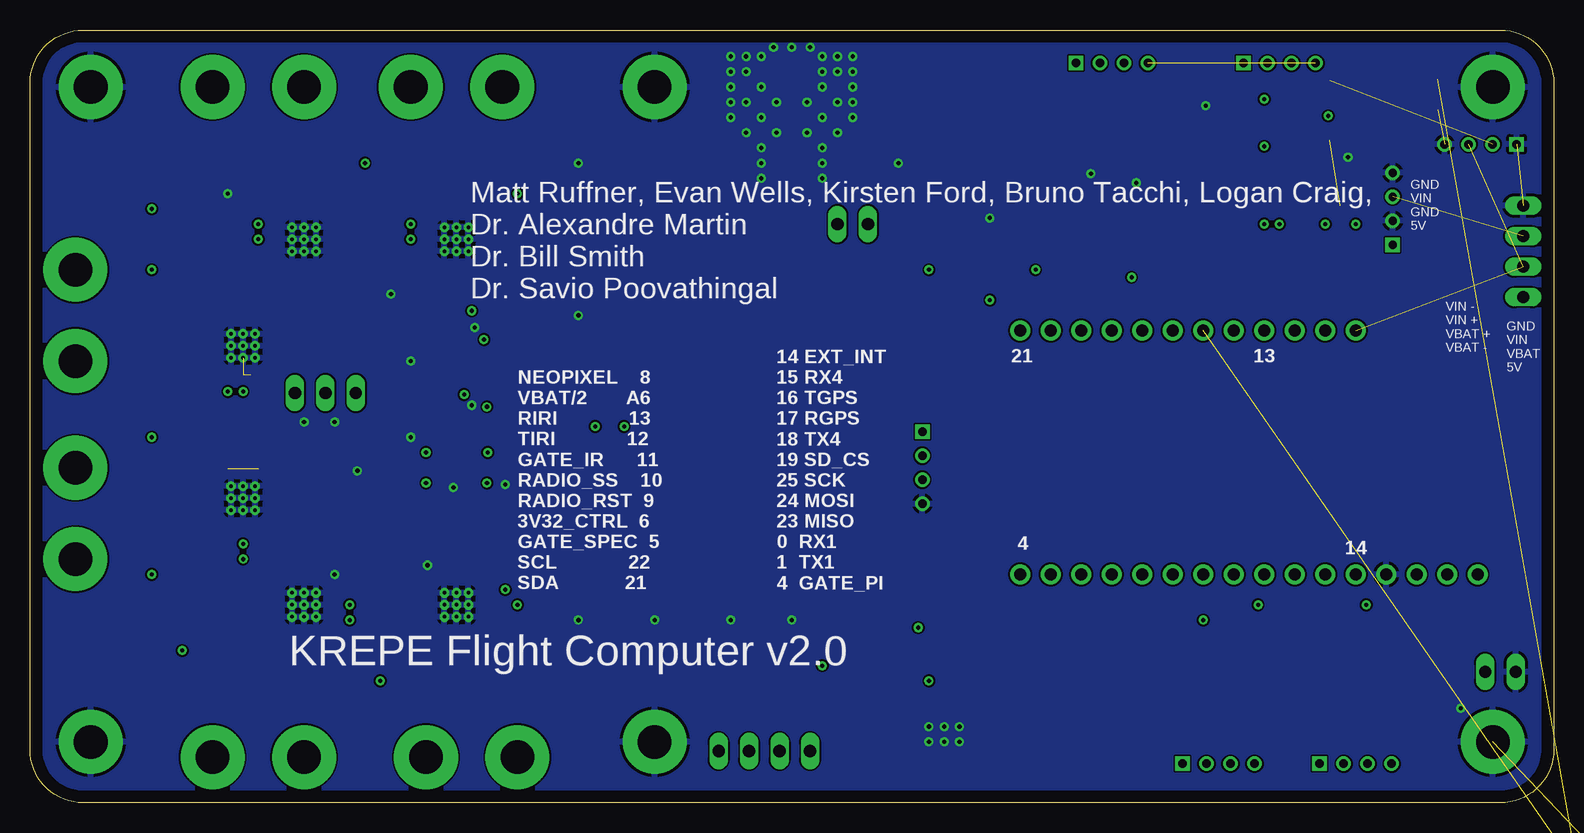
[diagram p7: board, bottom side, seen from below]

Size 126.98 x 64.44 mm. Coordinates in mm from the lower left corner, seen from the top.
Outline: 0,59.99 0,4.45 arc90 4.45,0 122.53,0 arc90 126.98,4.45 126.98,59.99 arc90 122.53,64.44 4.45,64.44 arc90 0,59.99
Copper layers (1*2+15*16): Top 0.035mm / dielectric 1.5mm / Route2 0.035mm / dielectric 0.15mm / Route15 0.035mm / dielectric 0.2mm / Bottom 0.035mm
Design rules "default *": minimum track width 6mil, minimum drill 0.35mm, track to track 6mil, track to pad 6mil, pad to pad 6mil, via to via 6mil, smd to smd 6mil, copper to edge 40mil, drill to drill 6mil, minimum pad ring 10mil, minimum via ring 8mil, stop-mask expansion 4mil, vias tented up to drill 14mil, thermal gap 10mil

### Footprints (pad centres in the part's own frame; a part is rotated, then mirrored left to right if it is on the bottom)
C0603 = smd 1.1 x 1: 1 -0.85,0; 2 0.85,0
0805-NO = smd 1.3 x 1.5: 1 -0.95,0; 2 0.95,0
0603-NO = smd 1.1 x 1: 1 -0.85,0; 2 0.85,0
2,8-PAD = drill 2.8 pad 5.334: B2,8 0,0
JST_B4B-PH-K-S(LF)(SN) = drill 0.7 square: 1 3,-0.55 | drill 0.7: 2 1,-0.55; 3 -1,-0.55; 4 -3,-0.55
MOLEX_104031-0811 = smd 0.85 x 1.1: 1 3.105,-5.45; 2 2.005,-5.45; 3 0.905,-5.45; 4 -0.195,-5.45; 5 -1.295,-5.45; 6 -2.395,-5.45; 7 -3.495,-5.45 | smd 0.75 x 1.1: 8 -4.545,-5.45 | smd 1.2 x 1: 9 5.74,0.7; 10 5.74,4.4 | smd 1.55 x 1.35: G1 5.565,-5.325 | smd 1.17 x 1.8: G2 -5.755,-5.1 | smd 1.9 x 1.35: G3 -3.73,5.375; G4 2.24,5.375
HRS_U.FL-R-SMT(10) = smd 1.05 x 1: 1 -1.525,0 | smd 2.2 x 1.05: 2 0,1.475; 3 0,-1.475
1X16_ROUND = drill 1 pad 1.676: 1 -19.05,0; 2 -16.51,0; 3 -13.97,0; 4 -11.43,0; 5 -8.89,0; 6 -6.35,0; 7 -3.81,0; 8 -1.27,0; 9 1.27,0; 10 3.81,0; 11 6.35,0; 12 8.89,0; 13 11.43,0; 14 13.97,0; 15 16.51,0; 16 19.05,0
1X04 = drill 1.016 long: 1 -3.81,0; 2 -1.27,0; 3 1.27,0; 4 3.81,0
1X12_ROUND = drill 1 pad 1.676: 1 -13.97,0; 2 -11.43,0; 3 -8.89,0; 4 -6.35,0; 5 -3.81,0; 6 -1.27,0; 7 1.27,0; 8 3.81,0; 9 6.35,0; 10 8.89,0; 11 11.43,0; 12 13.97,0
1X02 = drill 1.016 long: 1 -1.27,0; 2 1.27,0
1X03 = drill 1.016 long: 1 -2.54,0; 2 0,0; 3 2.54,0
CHIPLED_0603 = smd 0.8 x 0.8: A 0,-0.75; C 0,0.75
R0603 = smd 1 x 1.1: 1 -0.85,0; 2 0.85,0
SJ_2 = smd 1.168 x 1.6: 1 -1.524,0; 2 0,0; 3 1.524,0
SJ = smd 1.168 x 1.6: 1 -0.762,0; 2 0.762,0
MOD_COM-13909 = smd 3 x 1.2: 1 -7.5,7; 2 -7.5,5; 3 -7.5,3; 4 -7.5,1; 5 -7.5,-1; 6 -7.5,-3; 7 -7.5,-5; 8 -7.5,-7; 9 7.5,-7; 10 7.5,-5; 11 7.5,-3; 12 7.5,-1; 13 7.5,1; 14 7.5,3; 15 7.5,5; 16 7.5,7
PQFN50P300X300X100-16N = smd 0.53 x 0.35: 1 -1.22,1; 2 -1.22,0.5; 3 -1.22,0; 4 -1.22,-0.5; 5 -1.22,-1; 9 1.22,-1; 10 1.22,-0.5; 11 1.22,0; 12 1.22,0.5; 13 1.22,1 | smd 0.35 x 0.53: 6 -0.5,-1.22; 7 0,-1.22; 8 0.5,-1.22; 14 0.5,1.22; 15 0,1.22; 16 -0.5,1.22
SOP6 = smd 1.93 x 0.965: 1 -4.318,6.985; 2 -4.318,4.445; 3 -4.318,2.032; 4 4.699,1.905; 5 4.699,4.318; 6 4.699,6.858
QFN65P500X500X100-21N_MCP96L00T-E/MX = smd 0.81 x 0.32: 1 -2.45,1.3; 2 -2.45,0.65; 3 -2.45,0; 4 -2.45,-0.65; 5 -2.45,-1.3; 11 2.45,-1.3; 12 2.45,-0.65; 13 2.45,0; 14 2.45,0.65; 15 2.45,1.3 | smd 0.32 x 0.81: 6 -1.3,-2.45; 7 -0.65,-2.45; 8 0,-2.45; 9 0.65,-2.45; 10 1.3,-2.45; 16 1.3,2.45; 17 0.65,2.45; 18 0,2.45; 19 -0.65,2.45; 20 -1.3,2.45 | smd 3.25 x 3.25: 21 0,0 | drill 0.3 pad 0.5: 22 -1,1; 23 0,1; 24 1,1; 25 -1,0; 26 0,0; 27 1,0; 28 -1,-1; 29 0,-1; 30 1,-1
IC_ICM-42670-P = smd 0.475 x 0.25: 1 -1.163,0.75; 2 -1.163,0.25; 3 -1.163,-0.25; 4 -1.163,-0.75; 8 1.163,-0.75; 9 1.163,-0.25; 10 1.163,0.25; 11 1.163,0.75 | smd 0.25 x 0.475: 5 -0.5,-0.912; 6 0,-0.912; 7 0.5,-0.912; 12 0.5,0.912; 13 0,0.912; 14 -0.5,0.912
RQ_16_ADI = smd 1.981 x 0.351: 1 -2.465,2.24; 2 -2.465,1.6; 3 -2.465,0.96; 4 -2.465,0.32; 5 -2.465,-0.32; 6 -2.465,-0.96; 7 -2.465,-1.6; 8 -2.465,-2.24; 9 2.465,-2.24; 10 2.465,-1.6; 11 2.465,-0.96; 12 2.465,-0.32; 13 2.465,0.32; 14 2.465,0.96; 15 2.465,1.6; 16 2.465,2.24
SOT23-5 = smd 0.55 x 1.2: 1 -0.95,-1.3; 2 0,-1.3; 3 0.95,-1.3; 4 0.95,1.3; 5 -0.95,1.3
FSM300_FOOTPRINT = smd 1.778 x 1.016: 1 0,21.25; 2 0,19.25; 3 0,17.25; 4 0,13.208; 5 0,11.25; 6 0,9.25; 7 0,7.25; 8 0,5.25; 9 0,3.25; 10 20.32,3.25; 11 20.32,5.25; 12 20.32,7.25; 13 20.32,9.25; 14 20.32,11.25; 15 20.32,13.25; 16 20.32,17.25; 17 20.32,19.25; 18 20.32,21.25

### Placement (x,y rotation side)
C1  105.41,52.07 180 top
C2  38.61,51.31 180 top
C3  -2.54,-3.81 0 top  (outside the outline)
C6  37.59,57.02 270 top
C7  38.73,53.72 180 top
C8  33.78,57.91 270 top
C9  31.11,57.4 0 top
C10  115.57,39.37 90 top
C11  105.41,11.43 0 top
C12  91.44,52.07 180 top
C13  115.57,25.4 90 top
C14  97.41,30.48 180 top
C15  90.17,11.43 0 top
C17  95.38,34.16 90 top
C18  64.77,10.16 0 top
C19  101.6,30.48 0 top
C20  92.71,33.27 180 top
C22  48.9,49.4 90 top
C23  108.71,42.29 180 top
C24  86.36,45.72 270 top
C25  100.08,47.62 90 top
C26  95.63,14.99 270 top
C27  110.49,29.59 0 top
C28  109.22,15.24 270 top
C29  46.99,51.31 270 top
C30  52.07,53.34 0 top
H1  74.93,5.08 0 top
H2  74.93,59.69 0 top
H3  121.92,59.69 0 top
H4  121.92,5.08 0 top
H5  5.08,59.69 0 top
H6  5.08,5.08 0 top
H7  123.19,20.32 0 top
H8  123.19,27.94 0 top
H9  123.19,36.83 0 top
H10  123.19,44.45 0 top
H11  95.25,59.69 0 top
H12  87.63,59.69 0 top
H13  111.76,59.69 0 top
H14  104.14,59.69 0 top
H15  86.36,3.81 0 top
H16  93.98,3.81 0 top
H17  104.14,3.81 0 top
H18  111.76,3.81 0 top
J1  27.94,3.81 0 top
J2  36.83,62.23 0 top
J3  52.07,27.94 90 top
J4  22.86,62.23 0 top
J5  6.1,54.36 180 top
J6  16.51,3.81 0 top
J7  52.07,7.62 180 top
J8  13.97,49.53 270 top
J9  63.5,60.96 90 top
JP1  25.4,19.05 180 top
JP2  2.54,45.97 270 top
JP3  30.48,39.37 0 top
JP4  58.42,48.26 180 top
JP5  4.45,10.92 180 top
JP6  65.79,4.32 180 top
JP7  102.36,34.16 180 top
LED1  19.43,52.58 90 top
LED2  36.83,13.97 270 top
LED3  13.72,10.67 90 top
LED4  54.61,50.55 0 top
R1  92.96,22.73 180 top
R2  -2.54,-7.62 0 top  (outside the outline)
R3  92.96,21.21 180 top
R4  95.89,43.31 90 top
R7  40.64,44.45 0 top
R8  40.64,42.55 0 top
R9  98.42,43.31 90 top
R10  20.32,55.88 270 top
R11  30.48,13.97 0 top
R12  14.48,13.21 270 top
R13  118.11,38.1 180 top
R14  118.11,41.91 180 top
R15  102.87,8.89 90 top
R16  109.22,8.89 90 top
R17  118.11,22.86 180 top
R18  118.11,27.94 180 top
R19  88.9,54.61 270 top
R20  93.98,54.61 270 top
R21  105.41,54.61 270 top
R22  107.95,54.61 270 top
R23  87.63,8.89 90 top
R24  92.71,8.89 90 top
R25  97.79,15.24 90 top
R26  99.06,19.05 180 top
R27  54.61,46.99 90 top
R31  111.76,19.05 180 top
R32  104.14,24.13 270 top
R35  111.76,31.75 180 top
R36  106.68,31.75 0 top
R39  112.9,48.39 270 top
R40  110.49,48.26 270 top
R45  52.07,45.72 0 top
SJ1  24.13,53.34 0 top
SJ2  24.13,57.15 180 top
SJ3  88.65,24.51 180 top
SJ4  16.51,41.91 0 top
SJ5  90.17,29.21 90 top
SJ6  47.75,44.45 0 top
SJ7  87.38,29.21 90 top
SJ8  44.83,49.91 90 top
SJ9  58.42,44.45 180 top
SJ10  21.59,48.26 270 top
SJ11  17.78,48.26 270 top
U1  71.12,46.99 180 top
U2  91.31,36.2 270 top
U3  13.97,53.34 0 top
U4  109.22,38.1 180 top
U5  104.14,16.51 90 top
U6  97.79,26.67 90 top
U7  91.44,46.99 270 top
U8  91.44,16.51 90 top
U9  109.22,25.4 180 top
U10  104.14,46.99 270 top
U11  33.27,51.94 270 top
U13  52.07,49.53 0 top
U$4  85.09,12.7 90 top

### Tracks (layer width: path | path; a pad name or v marks a point on that pad's centre or on a via)
3V3  (via drill 0.35)
  Top 0.203: U6.12 96.02,27.17 95.76,27.43 95.76,28.45 96.27,28.96 98.51,28.96
  Top 0.254: U2.8 89.53,35.7 88.9,35.06 | U2.14 93.56,35.7 | U6.8 98.51,27.86 98.51,28.96 98.51,30.23 C14.1 | U6.5 99.34,26.17 100.75,27.58 C19.1 | 99.06,47.24 99.06,45.72 100.33,44.45 100.33,43.18 99.61,42.46 R9.1 | R1.1 94.36,22.73 95.5,21.59 95.5,15.96 C26.1 | U2.15 93.56,36.2
  Top 0.305: R7.1 37.25,44.45 36.62,43.81 v35.18,43.81 36.45,42.55 R8.1 | C20.1 93.56,32 92.29,30.73 SJ5.3 88.9,30.73 | U9.8 109.22,29.17 C27.1 109.64,30.1 110.02,30.48 113.03,30.48 | 113.03,30.48 v116.84,30.48 | R35.1 113.03,31.33 113.03,30.48 | R31.1 v116.84,19.05 | U8.8 94.96,16.51 C26.1 96.01,15.84 97.46,14.39 R25.1 v97.79,10.16 | U5.8 108.8,16.51 C28.1 110.91,16.09 v114.3,12.7 | U2.1 92.95,37.41 93.53,36.83 93.56,36.83 93.56,36.2 93.56,35.7 C20.1 | U4.8 109.22,42.29 C23.1 111.72,44.45 v116.84,44.45 | R39.1 115.66,49.24 115.95,49.53 v116.84,49.53 | U10.8 100.29,46.99 C25.1 99.53,46.77 99.06,47.24 v99.06,53.34 | U7.8 86.78,46.99 C24.1 v86.36,50.8 | C20.1 95.34,33.27 C17.1 97.5,33.31 98.26,32.55 C14.1 C19.1 | v88.9,26.67 90.3,25.27 90.04,25.02 90.17,24.89 SJ3.1 | 88.9,30.73 SJ7.3 87.38,34.42 88.02,35.06 88.9,35.06 | v88.84,29.21 88.9,29.27 88.9,30.73
  Top 0.406: v52.07,10.16 52.07,12.88 J7.4 | v60.96,11.43 62.23,10.16 C18.1 63.84,10.24 U$4.1
  Top 0.813: v35.18,43.81 39.75,48.39 SJ8.1
  Route2 0.305: 82.55,25.4 87.63,25.4 v88.9,26.67 88.9,29.21 v88.84,29.21
  Route2 0.813: 60.96,19.05 53.07,26.94 J3.3
  Route2 1.27: 59.69,10.16 v52.07,10.16 13.97,10.16 8.89,15.24 JP1.15 8.89,36.83 15.88,43.81 v35.18,43.81 | 59.69,10.16 v60.96,11.43 60.96,19.05 67.31,25.4 82.55,25.4 | v86.36,50.8 88.9,53.34 v99.06,53.34 113.03,53.34 v116.84,49.53 v116.84,44.45 v116.84,30.48 v116.84,19.05 116.84,15.24 v114.3,12.7 111.76,10.16 v97.79,10.16 59.69,10.16
3V32
  Top 0.813: C30.1 48.17,53.34 C29.1 45.55,52.16 SJ8.3 | C30.1 U13.5 | C30.1 51.12,55.88 54.61,55.88 57.53,52.96 57.53,48.64 JP4.2 57.66,47.75 SJ9.2
3V32_CTRL  (via drill 0.35)
  Top 0.254: U13.3 52.92,48.13 R45.2
  Top 0.305: v52.07,44.45 52.92,45.3 R45.2 54.19,45.72 R27.1
  Route15 0.305: JP3.9 39.37,41.91 44.45,41.91 46.99,44.45 v52.07,44.45
5V  (via drill 0.35)
  Top 0.813: SJ4.1 13.42,44.24 J8.1
  Top 1.016: J8.1 21.38,46.53 SJ10.3 SJ11.3 | v43.18,44.45 SJ6.1
  Route2 0.813: 15.51,4.81 15.78,5.08 | 26.67,5.08 26.94,4.81
  Route2 1.016: J8.1 34.75,46.53 36.83,44.45 v43.18,44.45
  Route2 1.27: J8.1 13.42,45.26 5.67,37.51 | 5.67,37.51 2.54,34.38 2.54,17.78 15.51,4.81 J6.3 | 15.78,5.08 26.67,5.08 | 26.94,4.81 J1.3 | 5.67,37.51 2.54,40.64 JP2.4
BOOTN
  Top 0.305: JP6.3 64.52,4.94 70.42,10.85 74.62,10.85 75.84,12.06 U$4.6
EXT_INT
  Top 0.508: JP1.12 8.38,10.92 JP5.1
FSM300_RESET
  Top 0.305: U$4.18 79.08,17.78 83.82,17.78 85.09,16.51 85.09,8.89 83.82,7.62 78.74,7.62 77.47,8.89 72.39,8.89 69.6,6.1 JP6.1
GATE_IRIDIUM  (via drill 0.35)  (1 unrouted)
  Top 0.305: 18.76,57.24 v18.8,57.28 19.77,57.28 R10.1
  Route15 0.305: JP3.6 29.21,45.72 18.8,56.13 v18.8,57.28
GATE_PI  (via drill 0.35)
  Top 0.305: v29.21,15.24 29.63,14.82 R11.1
  Route15 0.305: JP1.1 41.91,21.59 31.75,21.59 30.48,20.32 30.48,16.51 v29.21,15.24
GATE_SPEC  (via drill 0.35)
  Top 0.305: v15.62,16.51 14.48,15.37 R12.1
  Route2 0.305: JP3.10 39.37,33.02 27.94,21.59 27.94,17.78 26.67,16.51 v24.64,16.51 v15.62,16.51
GND  (via drill 0.35)  (8 unrouted)
  Top 0.254: C20.2 91.81,33.32 U2.12 91.77,35.02 91.77,35.63 91.82,35.69 91.82,36.07 | U2.13 92.31,33.47 92.11,33.27 C20.2 | U2.5 90.31,39.23 v89.92,39.62 | C20.2 90.3,33.27 v90.17,33.15 | v91.69,26.29 91.57,26.29 SJ5.1 | U6.6 99.26,26.67 99.44,26.85 99.44,27.18 | v99.69,27.69 99.69,27.43 99.44,27.18 | U8.1 90.14,15.21 U8.22 | U8.5 92.74,15.21 | U8.3 U8.25 | U8.18 U8.23 90.44,16.89 90.17,17.16 U8.17 | U2.16 92.19,36.7 91.82,36.32 91.82,36.07 | R4.1 96.86,42.46 v96.9,42.42 | R3.1 93.81,19.85 v93.85,19.81 | v34.8,51.69 34.8,51.18 34.87,51.1 U11.15 | C9.1 30.01,57.4 29.3,58.12 v29,58.12 | U6.7 99.43,27.17 99.44,27.18 | U5.13 U5.27 | U5.1 102.84,15.21 U5.22 | U5.3 U5.25 | U5.5 105.44,15.21 | U4.3 U4.25 | U4.1 110.52,36.8 U4.22 | U4.5 110.52,39.4 | U4.13 U4.27 | U4.7 109.87,39.45 U4.28 110.52,39.4 | U4.6 110.52,39.4 | U4.9 108.57,39.45 U4.30 | U10.13 U10.27 | U7.13 U7.27 | U10.3 U10.25 | U10.5 102.84,48.29 | U2.10 90.86,35.02 90.86,35.46 91.34,35.94 91.69,35.94 91.82,36.07 | C7.1 39.59,53.59 38.57,52.58 v38.57,52.45 39.46,51.56 C2.1
  Top 0.305: C27.2 110.52,28.77 U9.6 110.52,26.7 U9.28 110.49,26.67 111.64,26.67 U9.5 | R32.1 104.56,25.4 U9.13 U9.21 | R36.1 v104.14,31.75 | R26.1 v101.6,19.05 | U5.17 102.79,17.16 U5.24 | U5.18 U5.23 | C26.2 94.56,15.21 U8.6 92.74,15.21 U8.28 | U8.7 92.96,15.86 92.44,16.38 U8.29 | U8.9 92.79,17.16 U8.30 92.74,17.81 U8.10 | U8.13 U8.27 | C28.2 108.4,15.21 U5.6 105.44,15.21 U5.28 | U5.7 105.54,15.86 105.14,16.26 U5.29 | U9.3 U9.25 | U9.1 110.52,24.1 U9.22 | U9.18 U9.23 | U9.17 108.57,24.05 U9.24 | U5.9 105.49,17.16 U5.30 105.44,17.81 U5.10 | C23.2 107.92,42.23 U4.10 107.95,40.52 107.95,39.37 U4.30 | U10.1 105.44,47.02 105.41,46.99 105.14,47.26 U10.22 | U10.9 103.14,46.34 U10.29 | U10.10 102.84,45.69 U10.30 | U10.18 U10.23 | U10.17 104.49,46.34 U10.27 | R40.1 v110.49,50.8 | U7.9 90.44,46.34 U7.29 | U7.30 90.04,45.59 89.95,45.69 U7.10 88.07,45.69 87.25,44.87 C24.2 | U7.7 90.09,47.64 U7.28 90.14,48.29 | U7.6 90.14,48.29 | U7.5 90.14,48.29 | U7.3 U7.25 | U7.1 92.74,48.29 U7.22 | U7.18 U7.23 | U7.17 92.79,46.34 U7.24 92.74,45.69 | C17.2 95.25,35.14 v95.25,36.83 | C14.2 v95.25,30.48 | SJ5.1 SJ7.1 v87.38,26.54 87.38,24.77 SJ3.3 | C19.2 102.45,30.9 v101.6,31.75 | LED1.C 18.41,52.58 v17.14,53.85 | LED3.C 12.46,10.16 10.16,10.16 7.87,7.87 v7.75,7.87 | J7.G1 45.48,13.97 LED2.C | LED4.C v54.61,53.34 | U10.6 102.84,48.29 U10.28 102.79,47.64 U10.7 100.31,47.64 100.08,47.88 C25.2 100.26,48.29 U10.6
  Top 0.406: U13.2 52.13,48.28 52.13,51.68 53.02,52.58 C30.2 | U$4.2 65.84,10.38
  Top 0.813: v81.28,53.34 80.63,53.99 U1.8 | C30.2 v54.61,53.34 | v46.99,48.77 C29.2 46.99,50.35 C22.2 | U1.1 78.64,40.01 80.64,40.01 v81.28,40.64
  other vias: 63.5,15.24 74.93,15.24 68.58,15.24 81.28,15.24 49.53,6.35 50.8,6.35 52.07,6.35 52.07,5.08 50.8,5.08 49.53,5.08 58.42,60.96 58.42,59.69 58.42,58.42 58.42,57.15 59.69,55.88 60.96,54.61 60.96,53.34 60.96,52.07 66.04,52.07 66.04,53.34 66.04,54.61 67.31,55.88 68.58,57.15 68.58,58.42 68.58,59.69 68.58,60.96 68.58,62.23 67.31,62.23 66.04,62.23 65.02,62.99 63.5,62.99 61.98,62.99 60.96,62.23 58.42,62.23 59.69,62.23 60.96,57.15 59.69,58.42 59.69,60.96 60.96,60.96 60.96,59.69 62.23,58.42 62.23,55.88 64.77,55.88 64.77,58.42 66.04,57.15 67.31,58.42 66.04,59.69 67.31,60.96
  pour Bottom: -3.81,72.39 132.08,72.39 133.35,71.12 133.35,0 -2.54,0 -3.81,1.27
  pour Top: 62.23,8.89 62.23,15.24 63.5,16.51 82.55,16.51 83.82,15.24 83.82,8.89
  pour Top: 44.45,13.97 44.45,0 59.69,0 59.69,13.97
  pour Top: 57.15,63.5 57.15,57.15 59.69,54.61 59.69,52.07 60.96,50.8 62.23,50.8 66.04,50.8 67.31,52.07 67.31,54.61 69.85,57.15 69.85,63.5
GND_IRIDIUM  (1 unrouted)
H3_INT1  (via drill 0.35)
  Top 0.254: U2.11 91.31,34.54 v90.81,34.04
  Route2 0.254: v90.81,34.04 96.27,34.04 99.06,36.83 101.6,36.83 102.36,36.07 JP7.2
H3_INT2  (via drill 0.35)
  Top 0.203: U2.9 88.9,33.56 v88.9,33.02
  Route2 0.203: v88.9,33.02 90.17,31.75 97.79,31.75 99.82,33.78 JP7.3
HINTN
  Top 0.305: JP6.4 66.55,8.89 67.31,8.89 69.85,11.43 72.57,11.43 U$4.5
ICM_INT
  Top 0.254: U6.4 98.54,24.65 99.06,24.13 100.33,24.13 103.38,27.18 103.38,32.64 JP7.1
MISO
  Top 0.406: JP1.4 36.83,17.02 52.7,17.02 55.63,14.1 55.63,13.13 J7.7 55.56,27.62 62.87,34.92 70.48,34.92 77.55,41.99 U1.2
MOSI
  Top 0.305: JP1.5 48.26,33.02 59.44,33.02 62.23,35.81 69.09,35.81 77.47,44.2 77.47,44.45 78.16,44.45 U1.3
  Top 0.406: J7.3 51.16,14.24 49.28,16.13 34.92,16.13 34.29,16.76 JP1.5
N$1
  Top 0.813: U1.13 60.72,45.99 SJ9.1 59.69,44.96 JP4.1
N$2
  Top 0.813: R17.1 121.5,20.32 H7.B2,8
N$3  (via drill 0.35)
  Top 0.305: SJ2.2 v24.13,58.67
  Route2 0.305: v24.13,58.67 24.38,58.93 37.34,58.93 39.83,61.42 J2.1
N$4  (via drill 0.35)
  Top 0.305: SJ1.2 v24.13,54.74
  Route15 0.305: v24.13,54.74 26.67,57.28 33.43,57.28 J2.2
N$5
  Top 0.305: U11.1 35.83,54.41 C6.2
N$6  (via drill 0.35)
  Top 1.016: SJ10.2 v22.86,48.26 v24.13,48.26
  Route2 1.016: J2.3 35.83,61.48 34.16,59.82 34.14,59.84 23.14,59.84 21.78,58.48 21.78,51.88 24.13,49.53 v24.13,48.26 SJ10.2
N$7
  Top 0.203: U6.1 97.04,24.65
  Top 0.254: SJ5.2 91.44,29.21
  Top 0.305: 91.44,29.21 92.71,27.94 92.71,25.4 93.98,24.13 96.52,24.13 97.04,24.65
N$8
  Top 0.813: R18.1 H8.B2,8
N$9
  Top 0.254: C2.2 35.69,51.31 35.56,51.17
  Top 0.305: 35.56,51.17 35.56,49.52 U11.16 35.95,49.91 SJ8.2
N$10
  Top 0.254: R1.2 R3.2 91.22,20.32 89.41,20.32 88.14,19.05 88.14,18.16 88.49,17.81 U8.16
N$11
  Top 0.254: C7.2 36.87,52.7 34.29,52.7
  Top 0.305: U11.2 34.87,53.29 34.29,52.7
N$12
  Top 0.305: C6.1 35.6,55.88 34.23,55.88 U11.3
N$13
  Top 0.305: U11.4 33.59,56.19 33.78,56.37 C8.2
N$14
  Top 0.305: U11.5 32.95,58.76 C8.1
N$15
  Top 0.305: C9.2 32.31,57.05 U11.6
N$16  (via drill 0.35)
  Top 1.016: v19.05,48.26 SJ11.2 v16.51,48.26
  Route2 1.016: J4.3 21.86,60.72 20.32,59.18 20.32,49.4 19.68,48.77 19.56,48.77 v19.05,48.26 v16.51,48.26
N$17
  Top 0.254: U7.16 93.92,45.72 95.25,45.72 95.89,45.09 R4.2 R9.2
N$18  (2 unrouted)
N$19
  Top 0.305: R10.2 20.32,52.72 LED1.A
N$20
  Top 0.813: R13.1 121.92,38.1 H9.B2,8
N$21
  Top 0.813: R14.1 121.5,44.45 H10.B2,8
N$22
  Top 0.813: H11.B2,8 95.25,56.73 R20.1
N$23
  Top 0.813: R19.1 87.63,56.73 H12.B2,8
N$24
  Top 0.813: H13.B2,8 111.76,59.27 R22.1
N$25
  Top 0.813: R21.1 104.14,56.73 H14.B2,8
N$26
  Top 0.813: R23.1 87.63,5.08 H15.B2,8
N$27
  Top 0.813: R24.1 92.71,5.08 H16.B2,8
N$28
  Top 0.813: R15.1 104.14,6.77 H17.B2,8
N$29
  Top 0.813: R16.1 111.76,5.5 H18.B2,8
N$30
  Top 0.254: U13.1 51.12,45.82 R45.1
  Top 0.406: SJ6.2 47.75,47.31 C22.1 49.12,48.23 U13.1
N$31
  Top 0.305: J9.1 63.62,59.31
  Top 0.61: 63.62,59.31 U1.9
N$32
  Top 0.305: U4.2 113.23,37.45 114.3,38.52 C10.1
  Top 0.813: C10.1 115.99,38.1 R13.2
N$33
  Top 0.305: R11.2 LED2.A
N$34
  Top 0.305: U4.4 112.83,38.75 114.3,40.22 C10.2 | 117.05,41.7 R14.2
  Top 0.813: C10.2 117.05,41.7
N$35
  Top 0.254: U2.7 88.27,36.2 | SJ7.2 85.98,29.21 85.09,30.1 85.09,33.02
  Top 0.305: 85.09,33.02 88.27,36.2
N$36
  Top 0.305: R12.2 14.47,12.35 LED3.A
N$37
  Top 0.305: LED4.A R27.2
N$44
  Top 0.305: U$4.14 73.84,29.03 80.01,22.86 88.01,22.86 88.65,23.5 SJ3.2
N$45
  Top 0.305: C12.1 92.09,51.87 U7.2
  Top 0.813: R20.2 C12.1
N$46
  Top 0.305: C12.2 90.79,51.87 U7.4
  Top 0.813: C12.2 R19.2
N$47
  Top 0.305: U8.2 90.79,13.32 89.32,11.85 C15.1
  Top 0.813: C15.1 R23.2
N$48
  Top 0.305: U10.4 103.49,51 C1.2
  Top 0.813: R21.2 104.56,52.91 C1.2
N$49
  Top 0.305: U8.4 92.09,13.35 91.23,12.49 91.23,11.22
  Top 0.813: R24.2 91.23,11.22 C15.2
N$50
  Top 0.305: C1.1 104.79,50.6 U10.2
  Top 0.813: R22.2 C1.1
N$51
  Top 0.305: U9.2 113.26,24.75 113.46,24.55 C13.1 | 117.05,23.07 R17.2
  Top 0.813: C13.1 117.05,23.07
N$53
  Top 0.305: U9.4 115.37,26.05 C13.2 | 117.05,27.73 R18.2
  Top 0.813: C13.2 117.05,27.73
N$54
  Top 0.305: U5.2 103.49,12.5 C11.1
  Top 0.813: C11.1 R15.2
N$55
  Top 0.305: U5.4 104.79,13.32 106.26,11.85 C11.2 | 109.01,9.95 R16.2
  Top 0.813: C11.2 107.53,11.43 109.01,9.95
N$57
  Top 0.305: R25.2 97.79,18.63 98,18.84 | 98,18.84 R26.2 | U5.16 99.03,17.81 98,18.84
N$58
  Top 0.305: R32.2 105.62,21.8 | 105.62,21.8 108.37,19.05 R31.2 | U9.16 106.77,21.8 105.62,21.8
N$60
  Top 0.305: U4.16 107.92,31.76 107.91,31.75 R36.2 107.55,31.75 R35.2
N$62
  Top 0.305: U10.16 106.62,45.72 109.22,45.72 110.49,46.99 R40.2 110.62,47.54 R39.2
PS1
  Top 0.305: JP6.2 67.06,5.71 71.5,10.16 76.2,10.16 77.84,11.8 U$4.7
R232
  Top 0.305: J4.2 26.92,58.62 26.92,57.86 30.37,54.41 U11.8
R232_GPS
  Top 0.305: SJ1.1 22.99,53.72 22.99,55.07 23.47,55.55 24.79,55.55 25.35,54.99 | 25.35,54.99 25.4,54.99 | 25.35,54.99 25.48,54.86 26.16,54.86 27.81,53.21 27.81,52.83 28.32,52.32 32.13,52.32 33.59,50.86 U11.13
RADIO_RESET
  Top 0.305: JP3.8 34.29,38.1 35.56,36.83 59.69,36.83 61.06,38.2 65.5,38.2 77.3,49.99 U1.6
RADIO_SS
  Top 0.305: U1.5 77.2,47.99 66.55,37.34 61.34,37.34 59.56,35.56 34.29,35.56 31.75,38.1 JP3.7
RGPS
  Top 0.254: U11.12 32.95,44.38 30.48,41.91 30.48,25.4
  Top 0.305: SJ1.3 27.3,51.69 31.88,51.69 32.95,50.61 U11.12 | 30.48,25.4 JP1.9
RIRI
  Top 0.254: U11.9 31.03,46.27
  Top 0.305: 31.03,46.27 JP3.4
RX1
  Route15 0.305: J1.1 30.94,7.07 39.37,15.5 JP1.3
RX4
  Top 0.305: J6.1 17.78,4.99 17.78,17.78 JP1.11
SCK  (via drill 0.35)
  Top 0.305: JP1.6 46.99,34.29 59.31,34.29 61.59,36.58 67.06,36.58 76.2,45.72 80.01,45.72 79.74,45.99 U1.4
  Top 0.406: v52.96,14.61 53.37,14.2 J7.5
  Route2 0.305: v52.96,14.61 52.96,15.11 52.45,15.62 35.18,15.62 JP1.6
SCL  (via drill 0.35)
  Top 0.203: v93.98,29.21 93.98,27.94 95.25,26.67 U6.13
  Top 0.305: U$4.12 77.84,31.74 v77.47,31.37 | R8.2 41.91,42.12 JP3.11 | v90.17,41.02 90.81,40.38 U2.4 | v87.38,17.78 87.38,16.64 88.15,15.86 U8.19 | U5.19 100.98,15.86 v100.33,16.51 | v109.22,21.59 109.87,22.24 U9.19 | U4.19 109.87,34.94 v109.22,34.29 | U7.19 94.6,47.64 v95.25,46.99 | v107.95,46.99 107.3,47.64 U10.19
  Route15 0.305: JP3.11 50.34,30.94 J3.1 54.73,28.83 74.93,28.83 v77.47,31.37 80.39,34.29 83.62,34.29 90.17,40.84 v90.17,41.02 | v90.17,41.02 93.98,37.21 v93.98,29.21 | v93.98,29.21 95.25,27.94 95.25,26.67 | v87.38,17.78 87.38,18.8 95.25,26.67 | v100.33,16.51 96.27,20.57 96.27,25.65 | 95.25,26.67 96.27,25.65 | 96.27,25.65 100.33,21.59 v109.22,21.59 | v93.98,29.21 94.23,29.46 106.93,29.46 109.22,31.75 v109.22,34.29 | v90.17,41.02 95.25,46.1 v95.25,46.99 | v90.17,41.02 103.25,41.02 107.95,45.72 v107.95,46.99
SD_CS
  Top 0.406: J7.2 50.06,14.2 49.02,15.24 30.48,15.24 29.21,16.51 JP1.7
SDA  (via drill 0.35)
  Top 0.203: U6.14 94.49,26.16 v93.98,26.67
  Top 0.305: v79.88,31.37 79.84,31.41 U$4.11 | R7.2 41.91,44.45 44.45,41.91 JP3.12 | v89.15,38.63 89.15,36.7 U2.6 | v86.36,16.51 87.66,15.21 U8.20 | v100.33,15.24 100.36,15.27 100.42,15.21 U5.20 | U9.20 110.52,21.62 v109.22,20.32 | v110.49,34.29 110.49,35.62 U4.20 | U7.20 95.22,48.29 v95.25,48.26 | U10.20 107.92,48.29 v107.95,48.26
  Route2 0.305: JP3.12 44.45,37.11 J3.2 | v93.98,26.67 96.77,23.88 96.77,18.8 v100.33,15.24 | v93.98,26.67 100.33,20.32 v109.22,20.32 | v93.98,26.67 96.14,28.83 107.57,28.83 110.49,31.75 v110.49,34.29 | v95.25,48.26 96.52,46.99 96.52,44.45 90.7,38.63 v89.15,38.63 90.68,38.63 90.81,38.76 102.26,38.76 109.22,45.72 109.22,46.99 v107.95,48.26
  Route15 0.305: J3.2 53.62,27.94 76.45,27.94 v79.88,31.37 81.92,31.37 88.77,38.23 88.77,38.25 v89.15,38.63 89.15,38.61 92.71,35.05 92.71,27.94 v93.98,26.67 86.36,19.05 v86.36,16.51
T232
  Top 0.305: J4.1 25.86,60.54 27.5,58.89 27.5,58.17 29.34,56.34 30.9,56.34 31.67,55.58 U11.7
T232_GPS
  Top 0.305: SJ2.1 25.65,56.52 29.34,52.83 32.38,52.83 34.23,50.98 U11.14
TGPS
  Top 0.254: 27.94,40.64 32.31,45.01 U11.11
  Top 0.305: SJ2.3 22.61,55.37 21.59,54.36 21.59,52.32 21.72,52.2 26.04,52.2 27.2,51.03 31.85,51.03 32.31,50.56 U11.11 | JP1.10 27.94,25.4 27.94,40.64
TIRI
  Top 0.254: 31.67,45.64 U11.10
  Top 0.305: JP3.5 26.67,40.64 31.67,45.64
TX1
  Route15 0.305: J1.2 28.94,7.35 38.1,16.51 38.1,19.81 38.99,20.7 40.64,20.7 41.91,19.43 JP1.2
TX4
  Route15 0.305: JP1.8 25.02,17.4 17.65,17.4 16.51,16.26 16.51,4.89 17.51,3.9 J6.2
VBAT  (via drill 0.35)  (2 unrouted)
  Top 0.813: SJ6.3 49.28,43.55 47.64,41.91 v46.99,41.91
  Route2 0.813: JP3.1 16.51,40.85 16.98,41.32 46.4,41.32 v46.99,41.91
VBUS
  Top 0.813: SJ4.2 19.05,41.91 JP3.3
VIN  (2 unrouted)
  Top 1.016: J8.3 17.03,50.53 SJ11.1 SJ10.1
VIN_PRE  (1 unrouted)

### Text on the board
tNames: - | + | - | + | TC5 | 915Mhz ANT | TC5 | GND / 5V or VIN / R232 / T232 | V SELECT | H3 INT 1 / H3 INT 2 / ICM INT | VIN | 5v | J4 | J2 | VBUS to 5V | Radio power | X | - | TC4 | + | Y | Z | I2C | ADDR / SELECT | 3V3 / / GND | SCL / SDA / 3V3 / GND | 3V | - | GND | TC3 | + | ADDR / SELECT / FSM300 | GND | ACT | POL Switch / 3.3V TTL Serial | GND / 5V / TX / RX | BOOTN | GND / 5V / TX / RX | RST | TC1 | TC2 | INT | PS1 | + | - | + | -
bNames: GND / VIN / GND / 5V | Matt Ruffner, Evan Wells, Kirsten Ford, Bruno Tacchi, Logan Craig, / Dr. Alexandre Martin / Dr. Bill Smith / Dr. Savio Poovathingal | VIN - / VIN + / VBAT + / VBAT - | 13 | 21 | GND / VIN / VBAT / 5V | 14 | 4 | 14 EXT_INT / 15 RX4 / 16 TGPS / 17 RGPS / 18 TX4 / 19 SD_CS / 25 SCK / 24 MOSI / 23 MISO / 0 RX1 / 1 TX1 / 4 GATE_PI | NEOPIXEL 8 / VBAT/2 A6 / RIRI 13 / TIRI 12 / GATE_IR 11 / RADIO_SS 10 / RADIO_RST 9 / 3V32_CTRL 6 / GATE_SPEC 5 / SCL 22 / SDA 21 | KREPE Flight Computer v2.0